# Altium project KA2.PrjPcb (part 1 of 2)
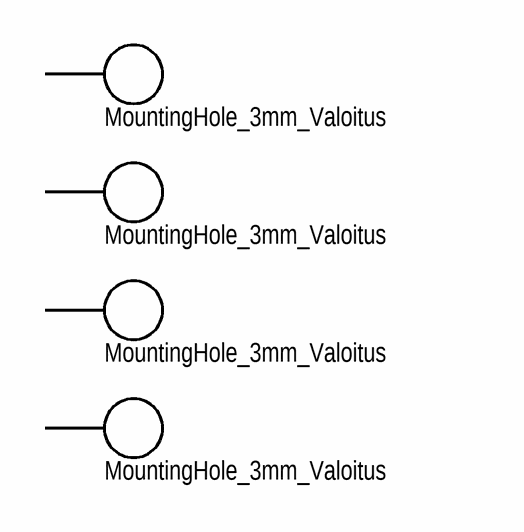
[diagram p0: KA2_1.SchDoc]
6 sheets, 277 parts. Net scope: flat (ports and power ports of the same name join across sheets).
Board file: KA2.PcbDoc
Sheets:
  KA2_1.SchDoc
  KA2_2.SchDoc
  KA2_3.SchDoc
  KA2_4.SchDoc
  KA2_5.SchDoc
  KA2_6.SchDoc

## Sheet KA2_1.SchDoc
size 420 x 297 mm; SheetNumber: 1; SheetTotal: 6

### Parts
H1  MountingHole_3mm_Valoitus  [MountingHole_Valoitus_3.2_5mm]  (no BOM)
H2  MountingHole_3mm_Valoitus  [MountingHole_Valoitus_3.2_5mm]  (no BOM)
H3  MountingHole_3mm_Valoitus  [MountingHole_Valoitus_3.2_5mm]  (no BOM)
H4  MountingHole_3mm_Valoitus  [MountingHole_Valoitus_3.2_5mm]  (no BOM)

### Nets

Not connected (* = marked no-connect by the designer): H1 1; H2 1; H3 1; H4 1

### Notes on the sheet
- Перв. примен.
- Справ. №
- Подп. дата
- Инв. № дубл.
- Взам. инв. №
- Подп. и дата
- Изм.
- Разраб.
- Лист
- № докум.
- Подп.
- Дата
- Лит.
- Масса
- Масштаб
- Пров.
- Т.контр.
- Листов
- Инв. № подл.
- Н.контр.
- Утв.
- ALTIUM GOSTBOM2.0 KEV
- Файл:
- Копировал
- Формат А3

## Sheet KA2_2.SchDoc
size 420 x 297 mm; SheetNumber: 2; SheetTotal: 6
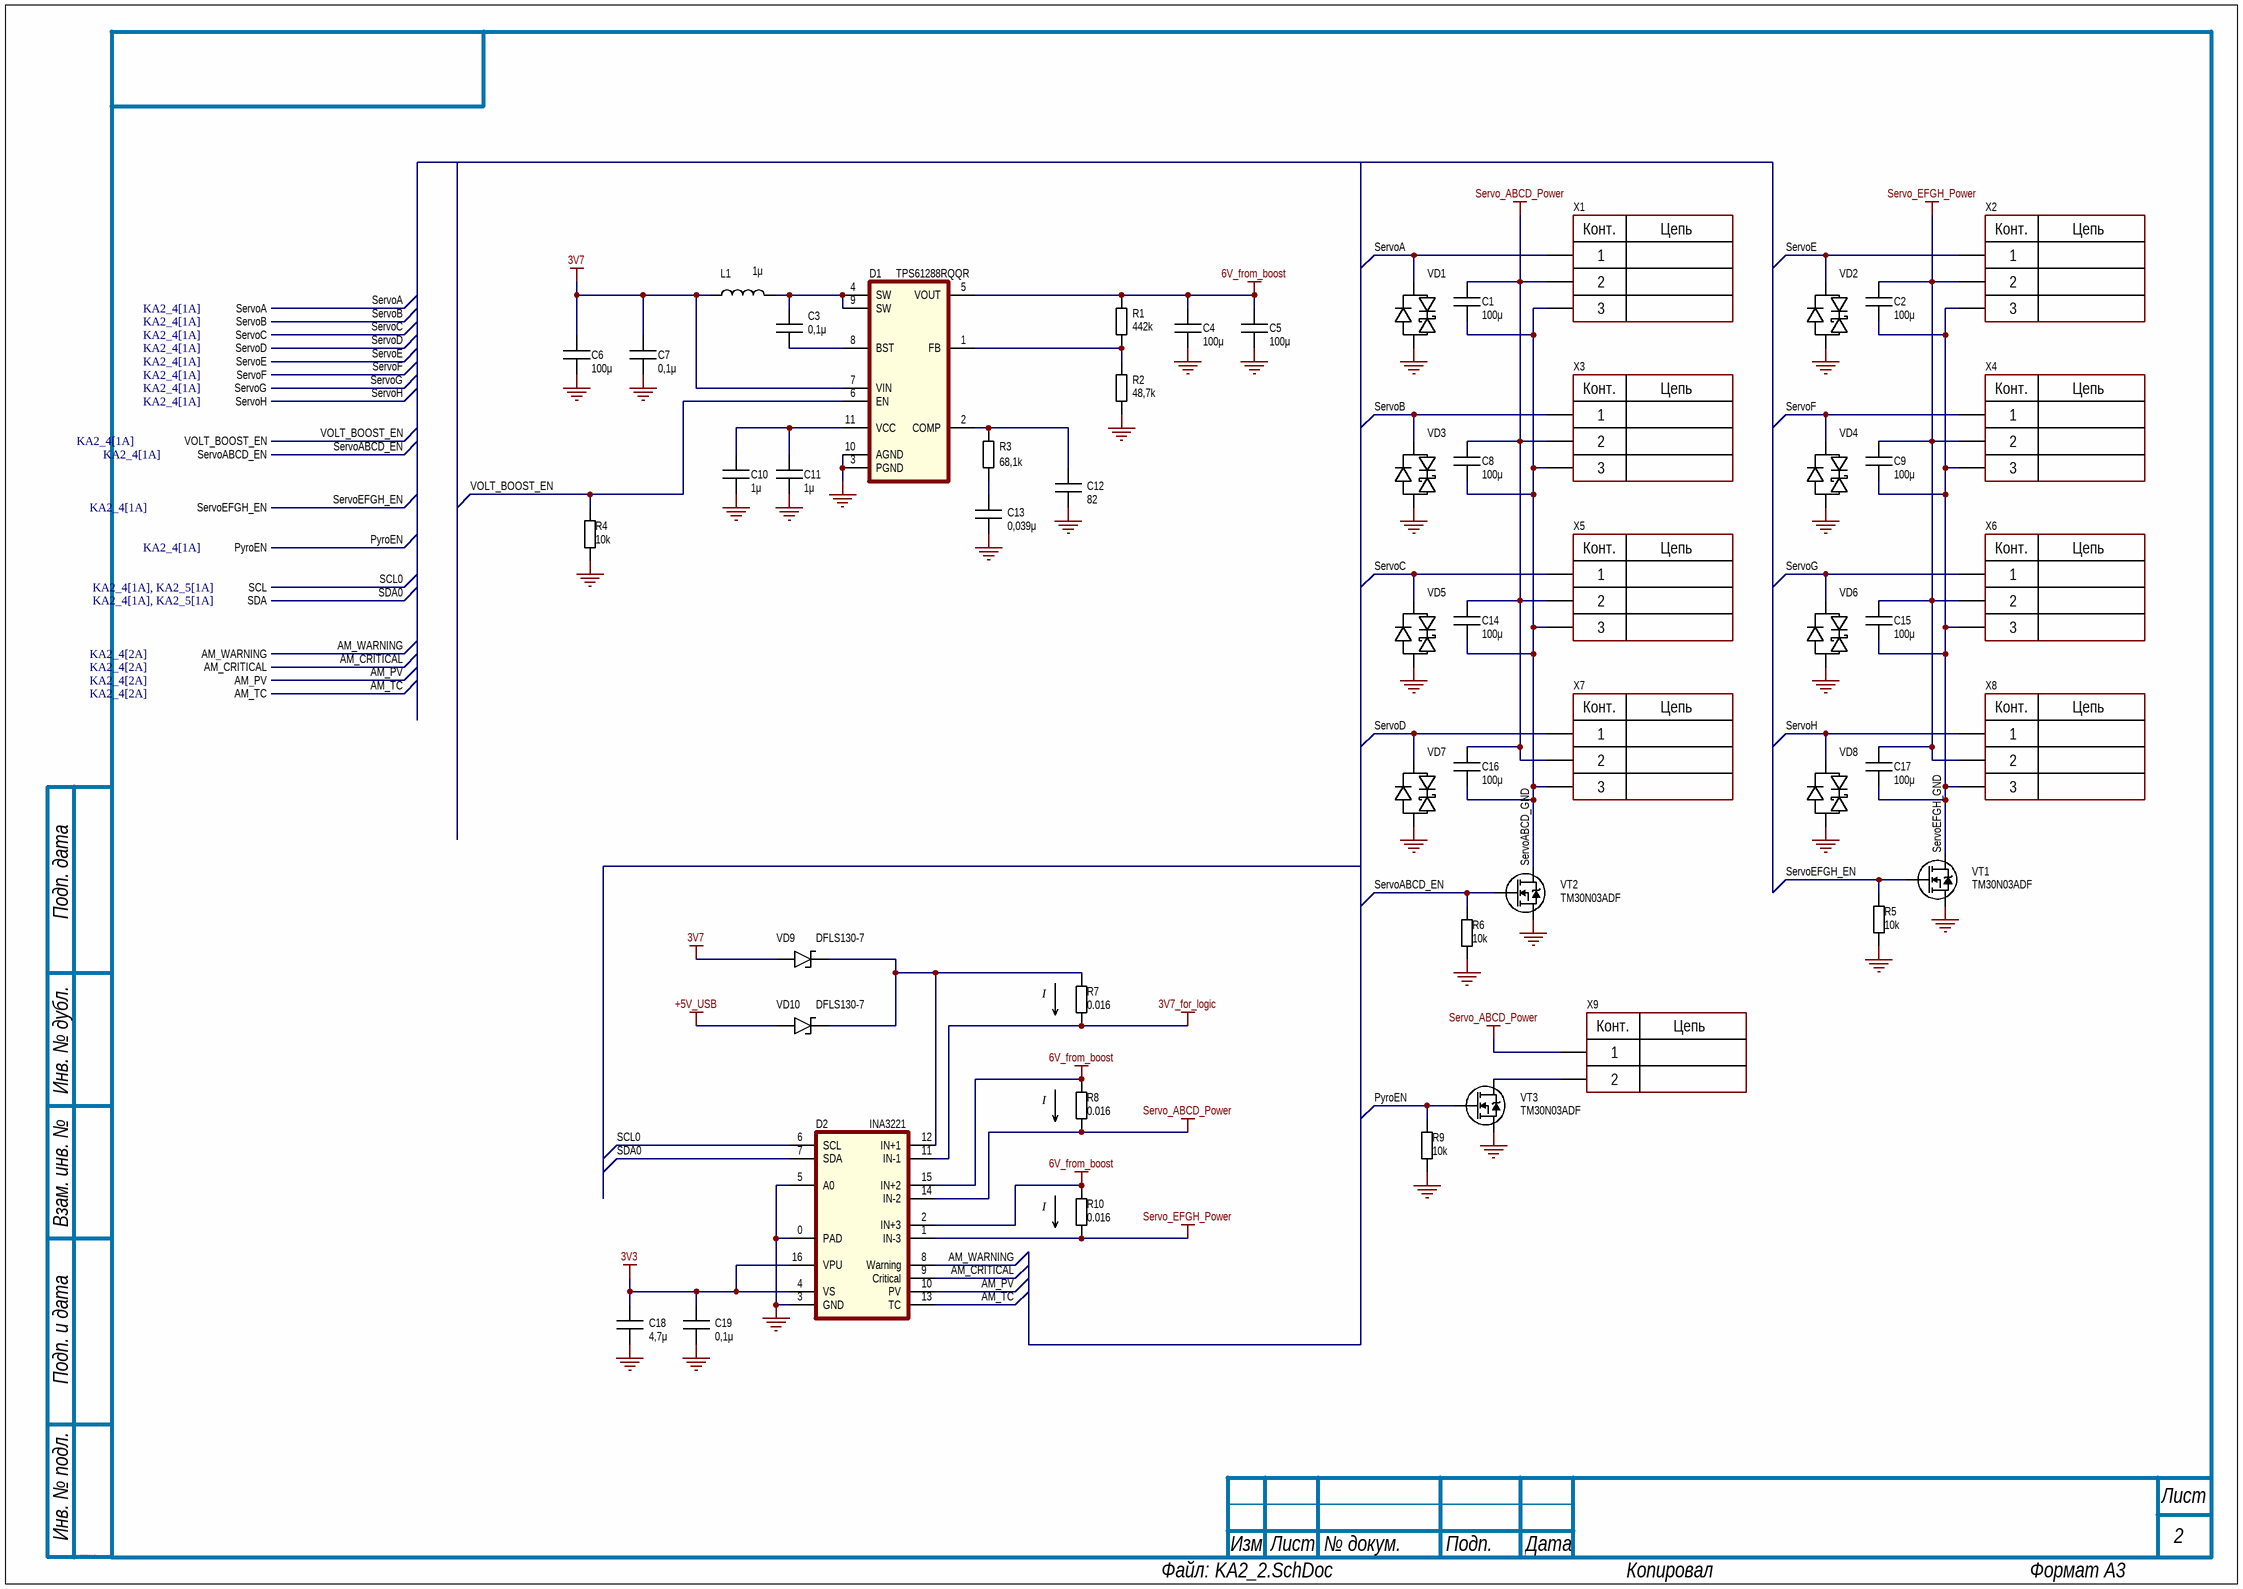
[diagram p1: KA2_2.SchDoc]

### Parts
C1  value 100μ  [Capacitor_1206]
C2  value 100μ  [Capacitor_1206]
C3  value 0,1μ  [Capacitor_0402]
C4  value 100μ  [Capacitor_1206]
C5  value 100μ  [Capacitor_1206]
C6  value 100μ  [Capacitor_1206]
C7  value 0,1μ  [Capacitor_0402]
C8  value 100μ  [Capacitor_1206]
C9  value 100μ  [Capacitor_1206]
C10  value 1μ  [Capacitor_0402]
C11  value 1μ  [Capacitor_0402]
C12  value 82  [Capacitor_0402]
C13  value 0,039μ  [Capacitor_0402]
C14  value 100μ  [Capacitor_1206]
C15  value 100μ  [Capacitor_1206]
C16  value 100μ  [Capacitor_1206]
C17  value 100μ  [Capacitor_1206]
C18  value 4,7μ  [Capacitor_0402]
C19  value 0,1μ  [Capacitor_0402]
D1  value TPS61288RQQR  [TPS61288]  (hidden comment: Boost Switching Regulator IC Adjustable 4.5V~18V 1 Output 15A VQFN-11-HR(2.5x3))
D2  INA3221  [QFN16_4x4mm]
L1  value 1μ  [Inductor_AWLU0730F-1R0MGA]  (hidden comment: 12A 1uH ±20% 7.4mΩ 15A Molded Inductor SMD,7x6.6mm Fixed Inductors RoHS)
R1  value 442k  [RES: 0402]
R2  value 48,7k  [RES: 0402]
R3  value 68,1k  [RES: 0402]
R4  value 10k  [RES: 0402]
R5  value 10k  [RES: 0402]
R6  value 10k  [RES: 0402]
R7  value 0.016  [RES: 1206]
R8  value 0.016  [RES: 1206]
R9  value 10k  [RES: 0402]
R10  value 0.016  [RES: 1206]
VD1  D1213A-01T  [SOD-523]  (value not drawn)
VD2  D1213A-01T  [SOD-523]  (value not drawn)
VD3  D1213A-01T  [SOD-523]  (value not drawn)
VD4  D1213A-01T  [SOD-523]  (value not drawn)
VD5  D1213A-01T  [SOD-523]  (value not drawn)
VD6  D1213A-01T  [SOD-523]  (value not drawn)
VD7  D1213A-01T  [SOD-523]  (value not drawn)
VD8  D1213A-01T  [SOD-523]  (value not drawn)
VD9  value DFLS130-7  [PowerDI-123]  (hidden comment: 1 Independent 30V 420mV@1A 1A PowerDI-123 Single Diodes RoHS)
VD10  value DFLS130-7  [PowerDI-123]  (hidden comment: 1 Independent 30V 420mV@1A 1A PowerDI-123 Single Diodes RoHS)
VT1  TM30N03ADF  [TM30N03ADF]
VT2  TM30N03ADF  [TM30N03ADF]
VT3  TM30N03ADF  [TM30N03ADF]
X1  Connector_JST_XH_B3B-XH-A_1x03_2.50mm  [CONN_JST_XH_B3B-XH-A_1x03_P2.50mm]  (value not drawn)  (no BOM)
X2  Connector_JST_XH_B3B-XH-A_1x03_2.50mm  [CONN_JST_XH_B3B-XH-A_1x03_P2.50mm]  (value not drawn)  (no BOM)
X3  Connector_JST_XH_B3B-XH-A_1x03_2.50mm  [CONN_JST_XH_B3B-XH-A_1x03_P2.50mm]  (value not drawn)  (no BOM)
X4  Connector_JST_XH_B3B-XH-A_1x03_2.50mm  [CONN_JST_XH_B3B-XH-A_1x03_P2.50mm]  (value not drawn)  (no BOM)
X5  Connector_JST_XH_B3B-XH-A_1x03_2.50mm  [CONN_JST_XH_B3B-XH-A_1x03_P2.50mm]  (value not drawn)  (no BOM)
X6  Connector_JST_XH_B3B-XH-A_1x03_2.50mm  [CONN_JST_XH_B3B-XH-A_1x03_P2.50mm]  (value not drawn)  (no BOM)
X7  Connector_JST_XH_B3B-XH-A_1x03_2.50mm  [CONN_JST_XH_B3B-XH-A_1x03_P2.50mm]  (value not drawn)  (no BOM)
X8  Connector_JST_XH_B3B-XH-A_1x03_2.50mm  [CONN_JST_XH_B3B-XH-A_1x03_P2.50mm]  (value not drawn)  (no BOM)
X9  Connector_JST_XH_B2B-XH-A_1x02_2.50mm  [CONN_JST_XH_B2B-XH-A_1x02_P2.50mm]  (value not drawn)  (no BOM)

### Ports
AM_CRITICAL (see KA2_4[2A]), AM_PV (see KA2_4[2A]), AM_TC (see KA2_4[2A]), AM_WARNING (see KA2_4[2A]), PyroEN (see KA2_4[1A]), SCL (see KA2_4[1A], KA2_5[1A]), SDA (see KA2_4[1A], KA2_5[1A]), ServoA (see KA2_4[1A]), ServoABCD_EN (see KA2_4[1A]), ServoB (see KA2_4[1A]), ServoC (see KA2_4[1A]), ServoD (see KA2_4[1A]), ServoE (see KA2_4[1A]), ServoEFGH_EN (see KA2_4[1A]), ServoF (see KA2_4[1A]), ServoG (see KA2_4[1A]), ServoH (see KA2_4[1A]), VOLT_BOOST_EN (see KA2_4[1A])

### Nets
3V3: C18.2 C19.2 D2.4(VS) D2.16(VPU)
3V7: C6.2 C7.2 D1.7(VIN) L1.2 VD9.A(Anode)
3V7_for_logic: D2.11(IN-1) R7.1
6V_from_boost: C4.2 C5.2 D1.5(VOUT) D2.2(IN+3) D2.15(IN+2) R1.2 R8.2 R10.2
+5V_USB: VD10.A(Anode)
GND: C4.1 C5.1 C6.1 C7.1 C10.1 C11.1 C12.1 C13.1 C18.1 C19.1 D1.3(PGND) D1.10(AGND) D2.0(PAD) D2.3(GND) D2.5(A0) R2.1 R4.1 R5.1 R6.1 R9.1 VD1.A VD2.A VD3.A VD4.A VD5.A VD6.A VD7.A VD8.A VT1.S VT2.S VT3.S
Servo_ABCD_Power: C1.2 C8.2 C14.2 C16.2 D2.14(IN-2) R8.1 X1.2 X3.2 X5.2 X7.2 X9.1
Servo_EFGH_Power: C2.2 C9.2 C15.2 C17.2 D2.1(IN-3) R10.1 X2.2 X4.2 X6.2 X8.2
AM_CRITICAL: D2.9(Critical) ; port AM_CRITICAL
AM_PV: D2.10(PV) ; port AM_PV
AM_TC: D2.13(TC) ; port AM_TC
AM_WARNING: D2.8(Warning) ; port AM_WARNING
PyroEN: R9.2 VT3.G ; port PyroEN
SCL0: D2.6(SCL) ; port SCL
SDA0: D2.7(SDA) ; port SDA
ServoA: VD1.K X1.1 ; port ServoA
ServoABCD_EN: R6.2 VT2.G ; port ServoABCD_EN
ServoABCD_GND: C1.1 C8.1 C14.1 C16.1 VT2.D X1.3 X3.3 X5.3 X7.3
ServoB: VD3.K X3.1 ; port ServoB
ServoC: VD5.K X5.1 ; port ServoC
ServoD: VD7.K X7.1 ; port ServoD
ServoE: VD2.K X2.1 ; port ServoE
ServoEFGH_EN: R5.2 VT1.G ; port ServoEFGH_EN
ServoEFGH_GND: C2.1 C9.1 C15.1 C17.1 VT1.D X2.3 X4.3 X6.3 X8.3
ServoF: VD4.K X4.1 ; port ServoF
ServoG: VD6.K X6.1 ; port ServoG
ServoH: VD8.K X8.1 ; port ServoH
VOLT_BOOST_EN: D1.6(EN) R4.2 ; port VOLT_BOOST_EN
NetC3_1: C3.1 D1.8(BST)
NetC3_2: C3.2 D1.4(SW) D1.9(SW) L1.1
NetC10_2: C10.2 C11.2 D1.11(VCC)
NetC12_2: C12.2 D1.2(COMP) R3.2
NetC13_2: C13.2 R3.1
NetD1_1: D1.1(FB) R1.1 R2.2
NetD2_12: D2.12(IN+1) R7.2 VD9.K(Kathode) VD10.K(Kathode)
NetVT3_D: VT3.D X9.2

### Notes on the sheet
- (near R7) I
- (near R8) I
- (near R10) I
- Подп. дата
- Инв. № дубл.
- Взам. инв. №
- Подп. и дата
- Инв. № подл.
- Изм.
- Лист
- № докум.
- Подп.
- Дата
- ALTIUM GOSTBOM2.0 KEV
- Файл:
- Копировал
- Формат А3
- (in symbol Connector_JST_XH_B2B-XH-A_1x02_2.50mm) Конт.; Цепь
- (in symbol Connector_JST_XH_B3B-XH-A_1x03_2.50mm) Конт.; Цепь

### Library data of the parts
C1 C2 C4-C6 C8 C9 C14-C17 = Ceramic_1206: ValueManufacturerPartNumber: Ceramic capacitor, 100μ, X7R, ±10%, 50V, 1206; TypeCapacitor: Ceramic capacitor; Tolerance: ±10%; TypeDielectric: X7R; Voltage: 50V; Manufacturer: *; HelpURL: *; Package: 1206; Mfr.Part: *
C3 C7 C19 = Ceramic_0402: ValueManufacturerPartNumber: Ceramic capacitor, 0,1μ, X7R, ±10%, 16V, 0402; TypeCapacitor: Ceramic capacitor; Tolerance: ±10%; TypeDielectric: X7R; Voltage: 16V; Manufacturer: *; HelpURL: *; Package: 0402; Mfr.Part: *
C10 C11 = Ceramic_0402: ValueManufacturerPartNumber: Ceramic capacitor, 1μ, X7R, ±10%, 16V, 0402; TypeCapacitor: Ceramic capacitor; Tolerance: ±10%; TypeDielectric: X7R; Voltage: 16V; Manufacturer: *; HelpURL: *; Package: 0402; Mfr.Part: *
C12 = Ceramic_0402: ValueManufacturerPartNumber: Ceramic capacitor, 82, X7R, ±10%, 16V, 0402; TypeCapacitor: Ceramic capacitor; Tolerance: ±10%; TypeDielectric: X7R; Voltage: 16V; Manufacturer: *; HelpURL: *; Package: 0402; Mfr.Part: *
C13 = Ceramic_0402: ValueManufacturerPartNumber: Ceramic capacitor, 0,039μ, X7R, ±10%, 16V, 0402; TypeCapacitor: Ceramic capacitor; Tolerance: ±10%; TypeDielectric: X7R; Voltage: 16V; Manufacturer: *; HelpURL: *; Package: 0402; Mfr.Part: *
C18 = Ceramic_0402: ValueManufacturerPartNumber: Ceramic capacitor, 4,7μ, X7R, ±10%, 16V, 0402; TypeCapacitor: Ceramic capacitor; Tolerance: ±10%; TypeDielectric: X7R; Voltage: 16V; Manufacturer: *; HelpURL: *; Package: 0402; Mfr.Part: *
D1 = TPS61288RQQR: Manufacturer: Texas Instruments; Mfr.Part: TPS61288RQQR; HelpURL: https://www.lcsc.com/product-image/C5219223.html
D2 = INA3221: Микросхема трехканального амперметра-вольтметра; Manufacturer: Texas Instruments; Mfr.Part: INA3221AIRGVR; Value: INA3221; HelpURL: https://www.lcsc.com/product-detail/C181255.html
L1 = Inductor_AWLU0730F-1R0MGA: 17A 1uH ±20% 3.8mΩ 21A Molded Inductor SMD,7.2x7mm Fixed Inductors RoHS; Manufacturer: APV; Mfr.Part: AWLU0730F-1R0MGA; HelpURL: https://www.lcsc.com/product-detail/C54123597.html
R1 = Resistor_0402: ValueManufacturerPartNumber: Resistor, 442k, ±1%, 0402; Tolerance: ±1%; Manufacturer: *; Package: 0402; Mfr.Part: *; TypeResistor: Resistor; HelpURL: *
R2 = Resistor_0402: ValueManufacturerPartNumber: Resistor, 48,7k, ±1%, 0402; Tolerance: ±1%; Manufacturer: *; Package: 0402; Mfr.Part: *; TypeResistor: Resistor; HelpURL: *
R3 = Resistor_0402: ValueManufacturerPartNumber: Resistor, 68,1k, ±1%, 0402; Tolerance: ±1%; Manufacturer: *; Package: 0402; Mfr.Part: *; TypeResistor: Resistor; HelpURL: *
R4-R6 R9 = Resistor_0402: ValueManufacturerPartNumber: Resistor, 10k, ±1%, 0402; Tolerance: ±1%; Manufacturer: *; Package: 0402; Mfr.Part: *; TypeResistor: Resistor; HelpURL: *
R7 R8 R10 = Resistor_1206: ValueManufacturerPartNumber: Resistor, 0.016, ±1%, 1206; Tolerance: ±1%; Manufacturer: *; Package: 1206; HelpURL: *; TypeResistor: Resistor; Mfr.Part: *
VD1-VD8 = D1213A-01T: Manufacturer: Diodes; Mfr.Part: D1213A-01T-7; Value: D1213A-01T-7; HelpURL: https://www.lcsc.com/product-detail/C460584.html
VD9 VD10 = Diode_DFLS130-7: Диод Шоттки 30V 420mV@1A 1A PowerDI-123; Mfr.Part: DFLS130-7; Manufacturer: DIODES; HelpURL: https://www.lcsc.com/product-detail/C150474.html
VT1-VT3 = TM30N03ADF: Транзистор N-канальный, 30В 30А 15Вт, DFN3x3-8; Manufacturer: Tritech-MOS; Mfr.Part: TM30N03ADF; Value: TM30N03ADF; HelpURL: https://www.lcsc.com/product-detail/C7422839.html
X1-X8 = Connector_JST_XH_B3B-XH-A_1x03_2.50mm: 3-pin through-hole connector
X9 = Connector_JST_XH_B2B-XH-A_1x02_2.50mm: 2-pin through-hole connector

## Sheet KA2_3.SchDoc
size 420 x 297 mm; SheetNumber: 3; SheetTotal: 6
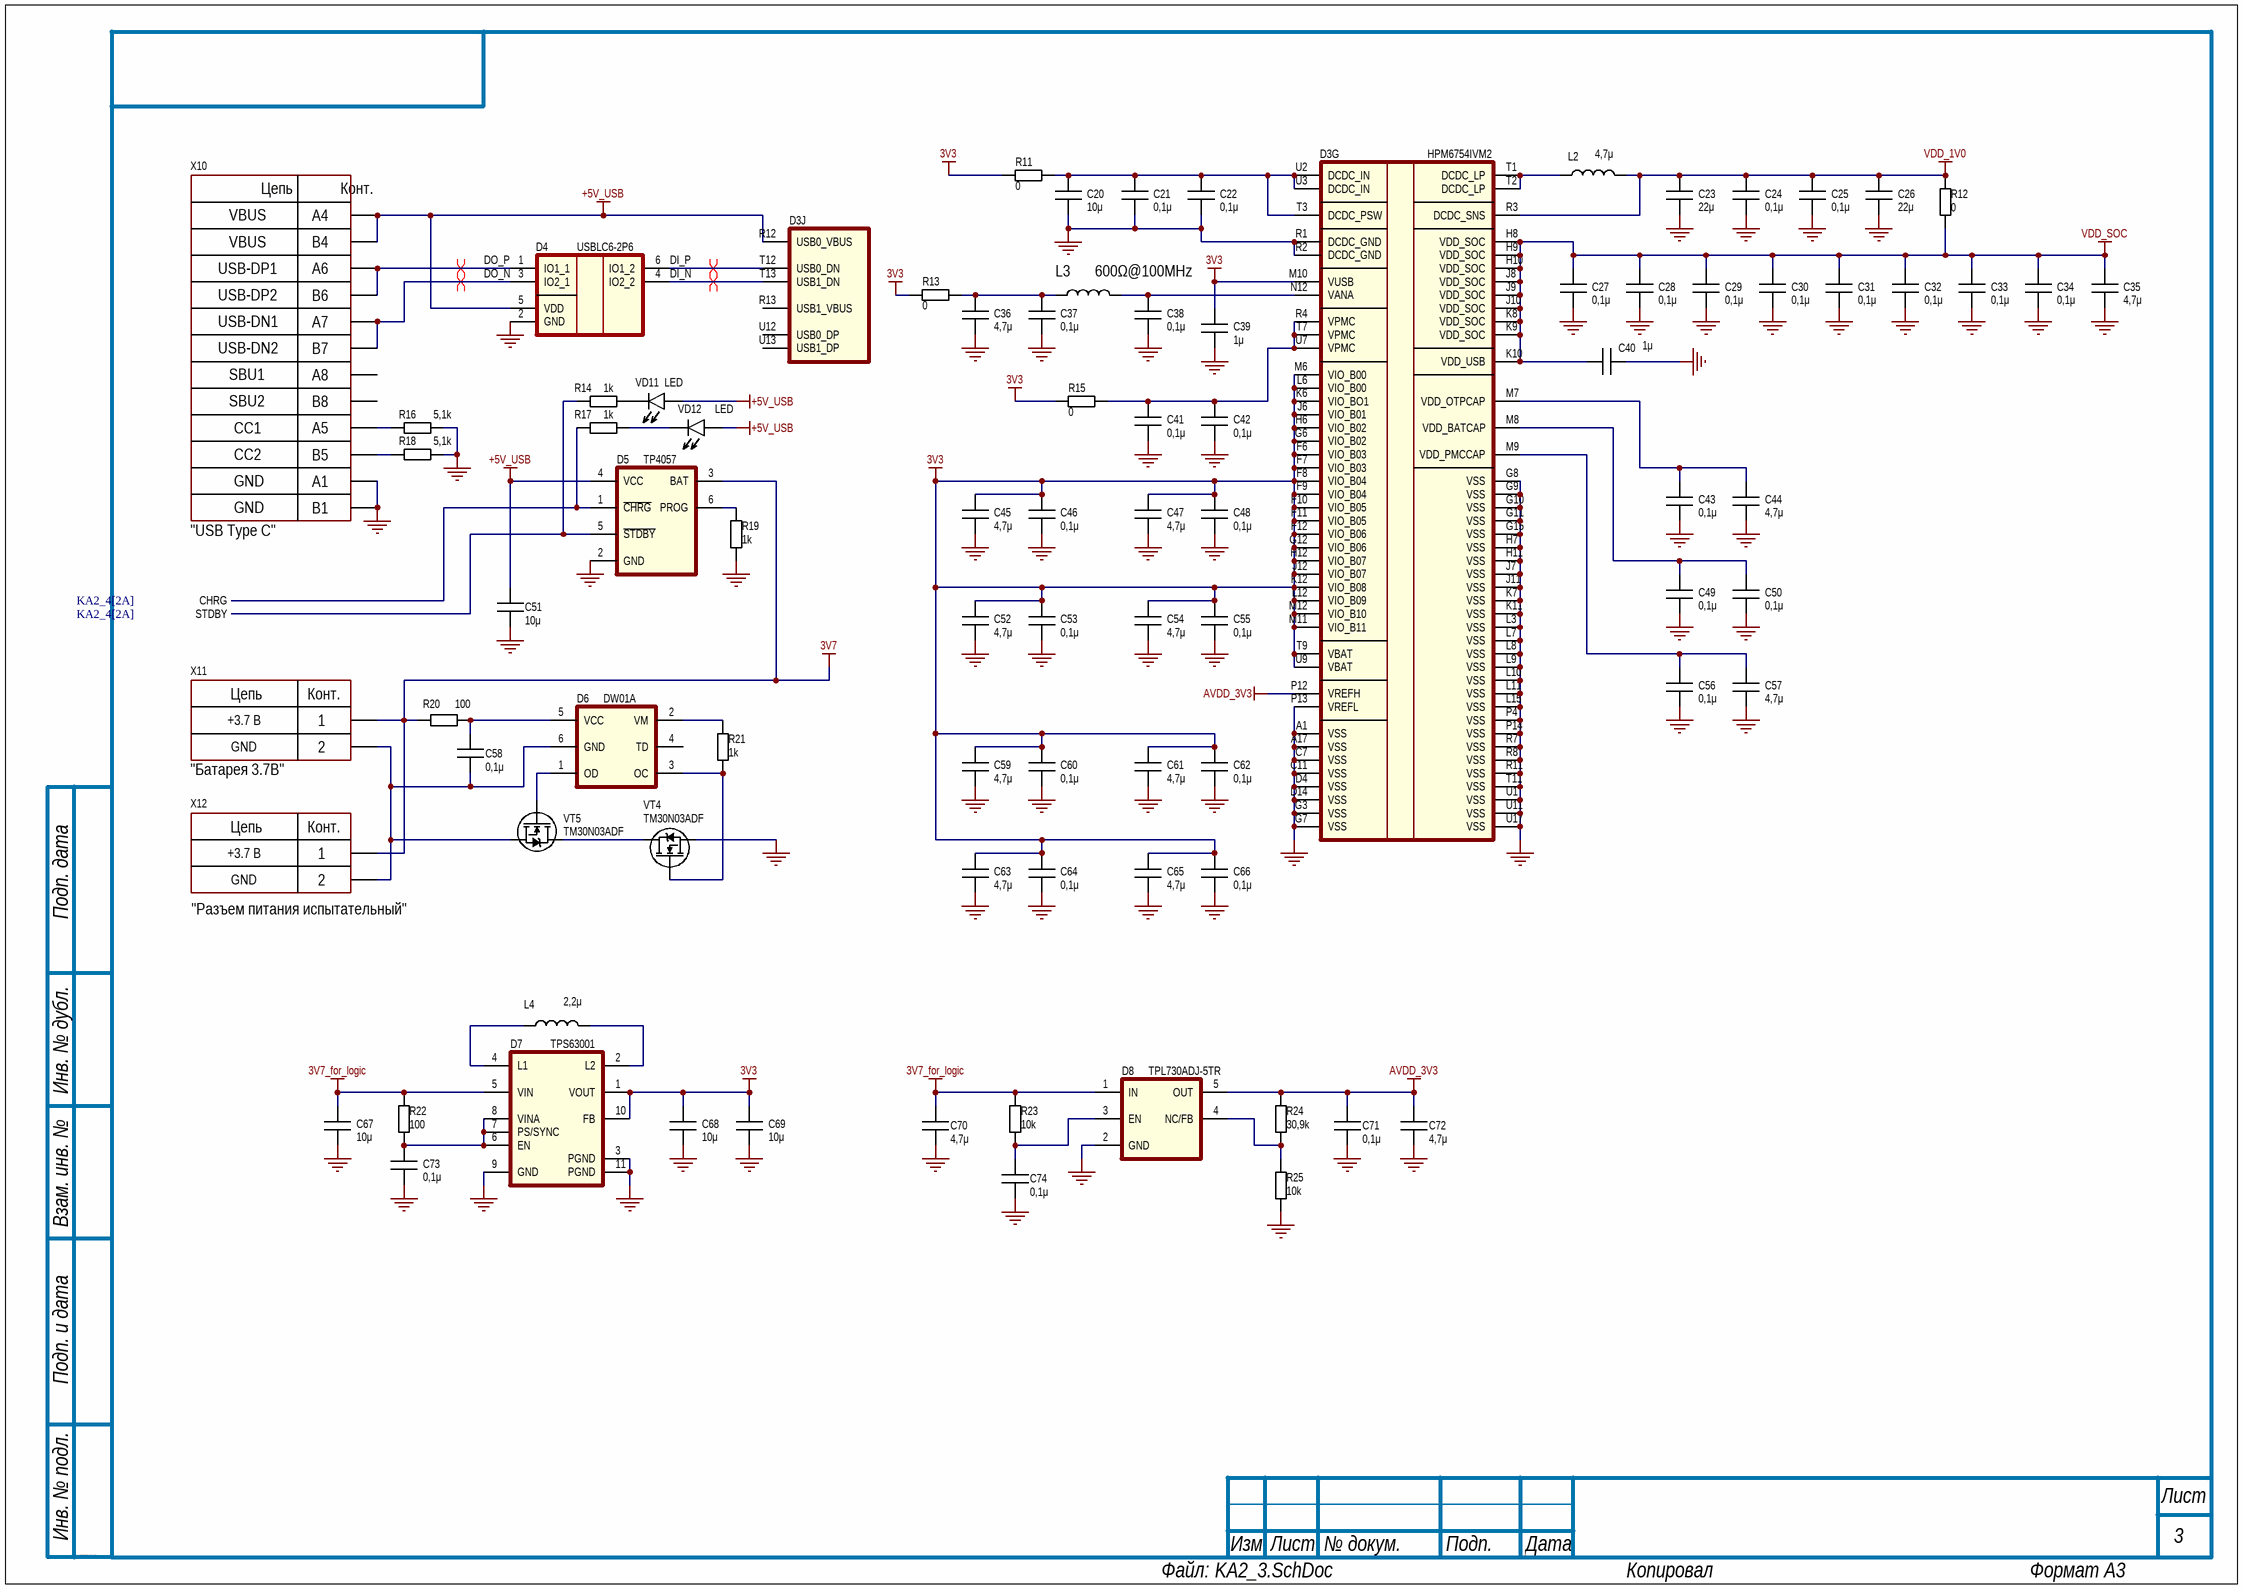
[diagram p2: KA2_3.SchDoc]

### Parts
C20  value 10μ  [Capacitor_0402]
C21  value 0,1μ  [Capacitor_0402]
C22  value 0,1μ  [Capacitor_0402]
C23  value 22μ  [Capacitor_0402]
C24  value 0,1μ  [Capacitor_0402]
C25  value 0,1μ  [Capacitor_0402]
C26  value 22μ  [Capacitor_0402]
C27  value 0,1μ  [Capacitor_0402]
C28  value 0,1μ  [Capacitor_0402]
C29  value 0,1μ  [Capacitor_0402]
C30  value 0,1μ  [Capacitor_0402]
C31  value 0,1μ  [Capacitor_0402]
C32  value 0,1μ  [Capacitor_0402]
C33  value 0,1μ  [Capacitor_0402]
C34  value 0,1μ  [Capacitor_0402]
C35  value 4,7μ  [Capacitor_0402]
C36  value 4,7μ  [Capacitor_0402]
C37  value 0,1μ  [Capacitor_0402]
C38  value 0,1μ  [Capacitor_0402]
C39  value 1μ  [Capacitor_0402]
C40  value 1μ  [Capacitor_0402]
C41  value 0,1μ  [Capacitor_0402]
C42  value 0,1μ  [Capacitor_0402]
C43  value 0,1μ  [Capacitor_0402]
C44  value 4,7μ  [Capacitor_0402]
C45  value 4,7μ  [Capacitor_0402]
C46  value 0,1μ  [Capacitor_0402]
C47  value 4,7μ  [Capacitor_0402]
C48  value 0,1μ  [Capacitor_0402]
C49  value 0,1μ  [Capacitor_0402]
C50  value 0,1μ  [Capacitor_0402]
C51  value 10μ  [Capacitor_0402]
C52  value 4,7μ  [Capacitor_0402]
C53  value 0,1μ  [Capacitor_0402]
C54  value 4,7μ  [Capacitor_0402]
C55  value 0,1μ  [Capacitor_0402]
C56  value 0,1μ  [Capacitor_0402]
C57  value 4,7μ  [Capacitor_0402]
C58  value 0,1μ  [Capacitor_0402]
C59  value 4,7μ  [Capacitor_0402]
C60  value 0,1μ  [Capacitor_0402]
C61  value 4,7μ  [Capacitor_0402]
C62  value 0,1μ  [Capacitor_0402]
C63  value 4,7μ  [Capacitor_0402]
C64  value 0,1μ  [Capacitor_0402]
C65  value 4,7μ  [Capacitor_0402]
C66  value 0,1μ  [Capacitor_0402]
C67  value 10μ  [Capacitor_0402]
C68  value 10μ  [Capacitor_0402]
C69  value 10μ  [Capacitor_0402]
C70  value 4,7μ  [Capacitor_0402]
C71  value 0,1μ  [Capacitor_0402]
C72  value 4,7μ  [Capacitor_0402]
C73  value 0,1μ  [Capacitor_0402]
C74  value 0,1μ  [Capacitor_0402]
D3  HPM6754IVM2  [HPM6754IVM2_BGA-289_14x14mm]  (parts G,J of 11)
D4  USBLC6-2P6  [SOT-666]
D5  TP4057  [SOT23-6]
D6  DW01A  [SOT23-6]
D7  TPS63001  [TPS6300x]
D8  value TPL730ADJ-5TR  [SOT-23-5]  (hidden comment: TPL730ADJ-5TL)
L2  value 4,7μ  [Inductor_1008]  (hidden comment: 1.55A 4.7uH ±20% 1.9A 196mΩ Magnetic Shielded Inductor 1008 Fixed Inductors RoHS)
L3  value 600Ω@100MHz  [IND: 0603]
L4  value 2,2μ  [Inductor_1008]  (hidden comment: 3A 2.2uH ±20% 55mΩ 3.8A 1008 Fixed Inductors RoHS)
R11  value 0  [RES: 0805]
R12  value 0  [RES: 0805]
R13  value 0  [RES: 0805]
R14  value 1k  [RES: 0402]
R15  value 0  [RES: 0805]
R16  value 5,1k  [RES: 0402]
R17  value 1k  [RES: 0402]
R18  value 5,1k  [RES: 0402]
R19  value 1k  [RES: 0402]
R20  value 100  [RES: 0402]
R21  value 1k  [RES: 0402]
R22  value 100  [RES: 0805]
R23  value 10k  [RES: 0402]
R24  value 30,9k  [RES: 0402]
R25  value 10k  [RES: 0402]
VD11  value LED  [LED: 0603Y]  (hidden comment: LED_0603_Y)
VD12  value LED  [LED: 0603Y]  (hidden comment: Red 625nm LED Indication - Discrete 2.3V 0603)
VT4  TM30N03ADF  [TM30N03ADF]
VT5  TM30N03ADF  [TM30N03ADF]
X10  CommentText: "USB Type C"  [CON: TYPE-C-31-M-12]  (hidden comment: USB-C (USB TYPE-C) Receptacle Connector 16 Position Surface Mount)
X11  "Батарея 3.7В"  [CONN_BATTERY_3V7_V2]  (no BOM)
X12  "Разъем питания испытательный"  [CONN_JST_XH_B2B-XH-A_1x02_P2.50mm]  (no BOM)

### Ports
CHRG (see KA2_4[2A]), STDBY (see KA2_4[2A])

### Nets
3V3: C39.2 C45.2 C46.2 C47.2 C48.2 C52.2 C53.2 C54.2 C55.2 C59.2 C60.2 C61.2 C62.2 C63.2 C64.2 C65.2 C66.2 C68.2 C69.2 D3.F6(VIO_B03) D3.F7(VIO_B03) D3.F8(VIO_B04) D3.F9(VIO_B04) D3.F10(VIO_B05) D3.F11(VIO_B05) D3.F12(VIO_B06) D3.G6(VIO_B02) D3.G12(VIO_B06) D3.H6(VIO_B02) D3.H12(VIO_B07) D3.J6(VIO_B01) D3.J12(VIO_B07) D3.K6(VIO_BO1) D3.K12(VIO_B08) D3.L6(VIO_B00) D3.L12(VIO_B09) D3.M6(VIO_B00) D3.M10(VUSB) D3.M11(VIO_B11) D3.M12(VIO_B10) D3.T9(VBAT) D3.U9(VBAT) D7.1(VOUT) D7.10(FB) R11.2 R13.2 R15.2
3V7: D5.3(BAT) R20.1 X11.1 X12.1
3V7_for_logic: C67.2 C70.2 D7.5(VIN) D8.1(IN) R22.1 R23.2
+5V_USB: C51.2 D3.R12(USB0_VBUS) D4.5(VDD) D5.4(VCC) VD11.A(Anode) VD12.A(Anode) X10.A4 X10.B4
AVDD_3V3: C71.2 C72.2 D3.P12(VREFH) D8.5(OUT) R24.2
GND: C20.1 C21.1 C22.1 C23.1 C24.1 C25.1 C26.1 C27.1 C28.1 C29.1 C30.1 C31.1 C32.1 C33.1 C34.1 C35.1 C36.1 C37.1 C38.1 C39.1 C40.1 C41.1 C42.1 C43.1 C44.1 C45.1 C46.1 C47.1 C48.1 C49.1 C50.1 C51.1 C52.1 C53.1 C54.1 C55.1 C56.1 C57.1 C59.1 C60.1 C61.1 C62.1 C63.1 C64.1 C65.1 C66.1 C67.1 C68.1 C69.1 C70.1 C71.1 C72.1 C73.1 C74.1 D3.A1(VSS) D3.A17(VSS) D3.C7(VSS) D3.C11(VSS) D3.D4(VSS) D3.D14(VSS) D3.G3(VSS) D3.G7(VSS) D3.G8(VSS) D3.G9(VSS) D3.G10(VSS) D3.G11(VSS) D3.G15(VSS) D3.H7(VSS) D3.H11(VSS) D3.J7(VSS) D3.J11(VSS) D3.K7(VSS) D3.K11(VSS) D3.L3(VSS) D3.L7(VSS) D3.L8(VSS) D3.L9(VSS) D3.L10(VSS) D3.L11(VSS) D3.L15(VSS) D3.P4(VSS) D3.P13(VREFL) D3.P14(VSS) D3.R1(DCDC_GND) D3.R2(DCDC_GND) D3.R7(VSS) D3.R8(VSS) D3.R11(VSS) D3.T11(VSS) D3.U1(VSS) D3.U11(VSS) D3.U17(VSS) D4.2(GND) D5.2(GND) D7.3(PGND) D7.9(GND) D7.11(PGND) D8.2(GND) R16.2 R18.2 R19.1 R25.1 VT4.S X10.A1 X10.B1
VDD_1V0: C23.2 C24.2 C25.2 C26.2 D3.R3(DCDC_SNS) L2.1 R12.2
VDD_SOC: C27.2 C28.2 C29.2 C30.2 C31.2 C32.2 C33.2 C34.2 C35.2 C40.2 D3.H8(VDD_SOC) D3.H9(VDD_SOC) D3.H10(VDD_SOC) D3.J8(VDD_SOC) D3.J9(VDD_SOC) D3.J10(VDD_SOC) D3.K8(VDD_SOC) D3.K9(VDD_SOC) D3.K10(VDD_USB) R12.1
CHRG: D5.1(~{CHRG}) R17.1 ; port CHRG
DI_N: D3.T13(USB1_DN) D4.4(IO2_2)
DI_P: D3.T12(USB0_DN) D4.6(IO1_2)
DO_N: D4.3(IO2_1) X10.A7 X10.B7
DO_P: D4.1(IO1_1) X10.A6 X10.B6
STDBY: D5.5(~{STDBY}) R14.1 ; port STDBY
NetC20_2: C20.2 C21.2 C22.2 D3.T3(DCDC_PSW) D3.U2(DCDC_IN) D3.U3(DCDC_IN) R11.1
NetC36_2: C36.2 C37.2 L3.2 R13.1
NetC38_2: C38.2 D3.N12(VANA) L3.1
NetC41_2: C41.2 C42.2 D3.R4(VPMC) D3.T7(VPMC) D3.U7(VPMC) R15.1
NetC43_2: C43.2 C44.2 D3.M7(VDD_OTPCAP)
NetC49_2: C49.2 C50.2 D3.M8(VDD_BATCAP)
NetC56_2: C56.2 C57.2 D3.M9(VDD_PMCCAP)
NetC58_1: C58.1 D6.6(GND) VT5.S X11.2 X12.2
NetC58_2: C58.2 D6.5(VCC) R20.2
NetC73_2: C73.2 D7.6(EN) D7.7(PS/SYNC) D7.8(VINA) R22.2
NetC74_2: C74.2 D8.3(EN) R23.1
NetD3_T1: D3.T1(DCDC_LP) D3.T2(DCDC_LP) L2.2
NetD5_6: D5.6(PROG) R19.2
NetD6_1: D6.1(OD) VT5.G
NetD6_2: D6.2(VM) R21.2
NetD6_3: D6.3(OC) R21.1 VT4.G
NetD7_2: D7.2(L2) L4.1
NetD7_4: D7.4(L1) L4.2
NetD8_4: D8.4(NC/FB) R24.1 R25.2
NetR14_2: R14.2 VD11.K(Kathode)
NetR16_1: R16.1 X10.A5
NetR17_2: R17.2 VD12.K(Kathode)
NetR18_1: R18.1 X10.B5
NetVT4_D: VT4.D VT5.D

Not connected (* = marked no-connect by the designer): D3 R13(USB1_VBUS) U12(USB0_DP) U13(USB1_DP); D6 4(TD); X10 A8 B8

### Layout directives
differential pair: DI_N, DI_P, DO_N, DO_P

### Notes on the sheet
- +3.7 В
- GND
- Подп. дата
- Инв. № дубл.
- Взам. инв. №
- Подп. и дата
- Инв. № подл.
- Изм.
- Лист
- № докум.
- Подп.
- Дата
- ALTIUM GOSTBOM2.0 KEV
- Файл:
- Копировал
- Формат А3
- (in symbol Connector_Battery) Цепь; Конт.; +3.7 В; GND
- (in symbol Connector_JST_XH_B2B-XH-A_1x02_2.50mm) Цепь; Конт.
- (in symbol Connector_USB_Type_C) Цепь; Конт.; VBUS; USB-DP1; USB-DP2; USB-DN1; USB-DN2; SBU1; SBU2; CC1; CC2; GND

### Library data of the parts
C20 C51 C67-C69 = Ceramic_0402: ValueManufacturerPartNumber: Ceramic capacitor, 10μ, X7R, ±10%, 16V, 0402; TypeCapacitor: Ceramic capacitor; Tolerance: ±10%; TypeDielectric: X7R; Voltage: 16V; Manufacturer: *; HelpURL: *; Package: 0402; Mfr.Part: *
C21 C22 C24 C25 C27-C34 C37 C38 C41-C43 C46 C48-C50 C53 C55 C56 C58 C60 C62 C64 C66 C71 C73 C74 = Ceramic_0402: as C3 on sheet KA2_2; Manufacturer: *; HelpURL: *; Package: 0402; Mfr.Part: *
C23 C26 = Ceramic_0402: ValueManufacturerPartNumber: Ceramic capacitor, 22μ, X7R, ±10%, 16V, 0402; TypeCapacitor: Ceramic capacitor; Tolerance: ±10%; TypeDielectric: X7R; Voltage: 16V; Manufacturer: *; HelpURL: *; Package: 0402; Mfr.Part: *
C35 C36 C44 C45 C47 C52 C54 C57 C59 C61 C63 C65 C70 C72 = Ceramic_0402: as C18 on sheet KA2_2; Manufacturer: *; HelpURL: *; Package: 0402; Mfr.Part: *
C39 C40 = Ceramic_0402: as C10 on sheet KA2_2; Manufacturer: *; HelpURL: *; Package: 0402; Mfr.Part: *
D3 = HPM6754IVM2: Микроконтроллер RISC-V, 2xRV32GCBP@816МГц, 2МБ ОЗУ, BGA-289 14x14mm; Manufacturer: HPMICRO; Mfr.Part: HPM6754IVM2; Value: HPM6754IVM2; HelpURL: https://www.lcsc.com/product-detail/C49451874.html
D4 = USBLC6-2P6: Микросхема защиты USB от статики, SOT-666; Manufacturer: STMicroelectronics; Mfr.Part: USBLC6-2P6; Value: USBLC6-2P6; HelpURL: https://www.lcsc.com/product-detail/C15999.html
D5 = TP4057: Микросхема зарядки li-ion барареи, SOT-23-6; Manufacturer: JSMSEMI; Mfr.Part: TP4057; Value: TP4057; HelpURL: https://www.lcsc.com/product-detail/C20606861.html
D6 = DW01A: Микросхема защиты li-ion-батареи; Mfr.Part: DW01A-JSM; Manufacturer: JSMSEMI; Value: DW01A; HelpURL: https://www.lcsc.com/product-detail/C39846919.html
D7 = TPS63001: Микросхема драйвера повышающе-понижающего преобразователя, вход 1,8...5,5В, выход 3,3В, 800-1200мА; Mfr.Part: TPS63001DRCR; Manufacturer: Texas Instruments; Value: TPS63001; HelpURL: https://www.lcsc.com/product-detail/C28060.html
D8 = TPL730ADJ-5TL: Микросхема драйвера импульсного понижающего преобразователя; Manufacturer: 3PEAK; Mfr.Part: TPL730ADJ-5TR; HelpURL: https://www.lcsc.com/product-detail/C2690181.html
L2 = Inductor_FWP252012P-4R7ML: Manufacturer: cjiang; Mfr.Part: FWP252012P-4R7ML; HelpURL: https://www.lcsc.com/product-detail/C5179447.html
L3 = Inductor_0603: ValueManufacturerPartNumber: Inductor, 600Ω@100MHz, ±10%, 0603; Tolerance: ±10%; Manufacturer: *; Mfr.Part: *; Package: 0603; HelpURL: *; TypeInductor: Inductor
L4 = Inductor_FTC252012S2R2MBCA: Manufacturer: cjiang; Mfr.Part: FTC252012S2R2MBCA; HelpURL: https://www.lcsc.com/product-detail/C5832372.html
R11-R13 R15 = Resistor_0805: ValueManufacturerPartNumber: Resistor, 0, ±1%, 0805; Tolerance: ±1%; Manufacturer: *; Package: 0805; HelpURL: *; TypeResistor: Resistor; Mfr.Part: *
R14 R17 R21 = Resistor_0402: ValueManufacturerPartNumber: Resistor, 1k, ±1%, 0402; Tolerance: ±1%; Manufacturer: *; Package: 0402; Mfr.Part: *; TypeResistor: Resistor; HelpURL: *
R16 R18 = Resistor_0402: ValueManufacturerPartNumber: Resistor, 5,1k, ±1%, 0402; Tolerance: ±1%; Manufacturer: *; Package: 0402; Mfr.Part: *; TypeResistor: Resistor; HelpURL: *
R19 = Resistor_0402: Manufacturer: Yageo; ValueManufacturerPartNumber: Resistor, 1k, ±1%, 0402; Tolerance: ±1%; Package: 0402; TypeResistor: Resistor
R20 = Resistor_0402: ValueManufacturerPartNumber: Resistor, 100, ±1%, 0402; Tolerance: ±1%; Manufacturer: *; Package: 0402; Mfr.Part: *; TypeResistor: Resistor; HelpURL: *
R22 = Resistor_0805: ValueManufacturerPartNumber: Resistor, 100, ±1%, 0805; Tolerance: ±1%; Manufacturer: *; Package: 0805; HelpURL: *; TypeResistor: Resistor; Mfr.Part: *
R23 R25 = Resistor_0402: as R4 on sheet KA2_2; Manufacturer: *; Package: 0402; Mfr.Part: *; TypeResistor: Resistor; HelpURL: *
R24 = Resistor_0402: ValueManufacturerPartNumber: Resistor, 30,9k, ±1%, 0402; Tolerance: ±1%; Manufacturer: *; Package: 0402; Mfr.Part: *; TypeResistor: Resistor; HelpURL: *
VD11 = LED_0603_Y: Светодиод желтый, 0603; Mfr.Part: TJ-S1608CY6T5ALC9Y-A5; Manufacturer: TOGIALED; HelpURL: https://www.lcsc.com/product-detail/C2837010.html
VD12 = LED_0603_R: Светодиод красный, 0603; Mfr.Part: XL-1608SURC-06; Manufacturer: XINGLIGHT; HelpURL: https://www.lcsc.com/product-detail/C965799.html
VT4 VT5 = TM30N03ADF: as VT1 on sheet KA2_2; Mfr.Part: TM30N03ADF; Value: TM30N03ADF; HelpURL: https://www.lcsc.com/product-detail/C7422839.html
X10 = Connector_USB_Type_C: 16-pin USB-C connector, surface mount; Manufacturer: HDGC; Mfr.Part: TYPE C-DB-116PWB; HelpURL: https://www.lcsc.com/product-detail/C7395062.html
X11 = Connector_Battery
X12 = Connector_JST_XH_B2B-XH-A_1x02_2.50mm

## Sheet KA2_4.SchDoc
size 420 x 297 mm; SheetNumber: 4; SheetTotal: 6
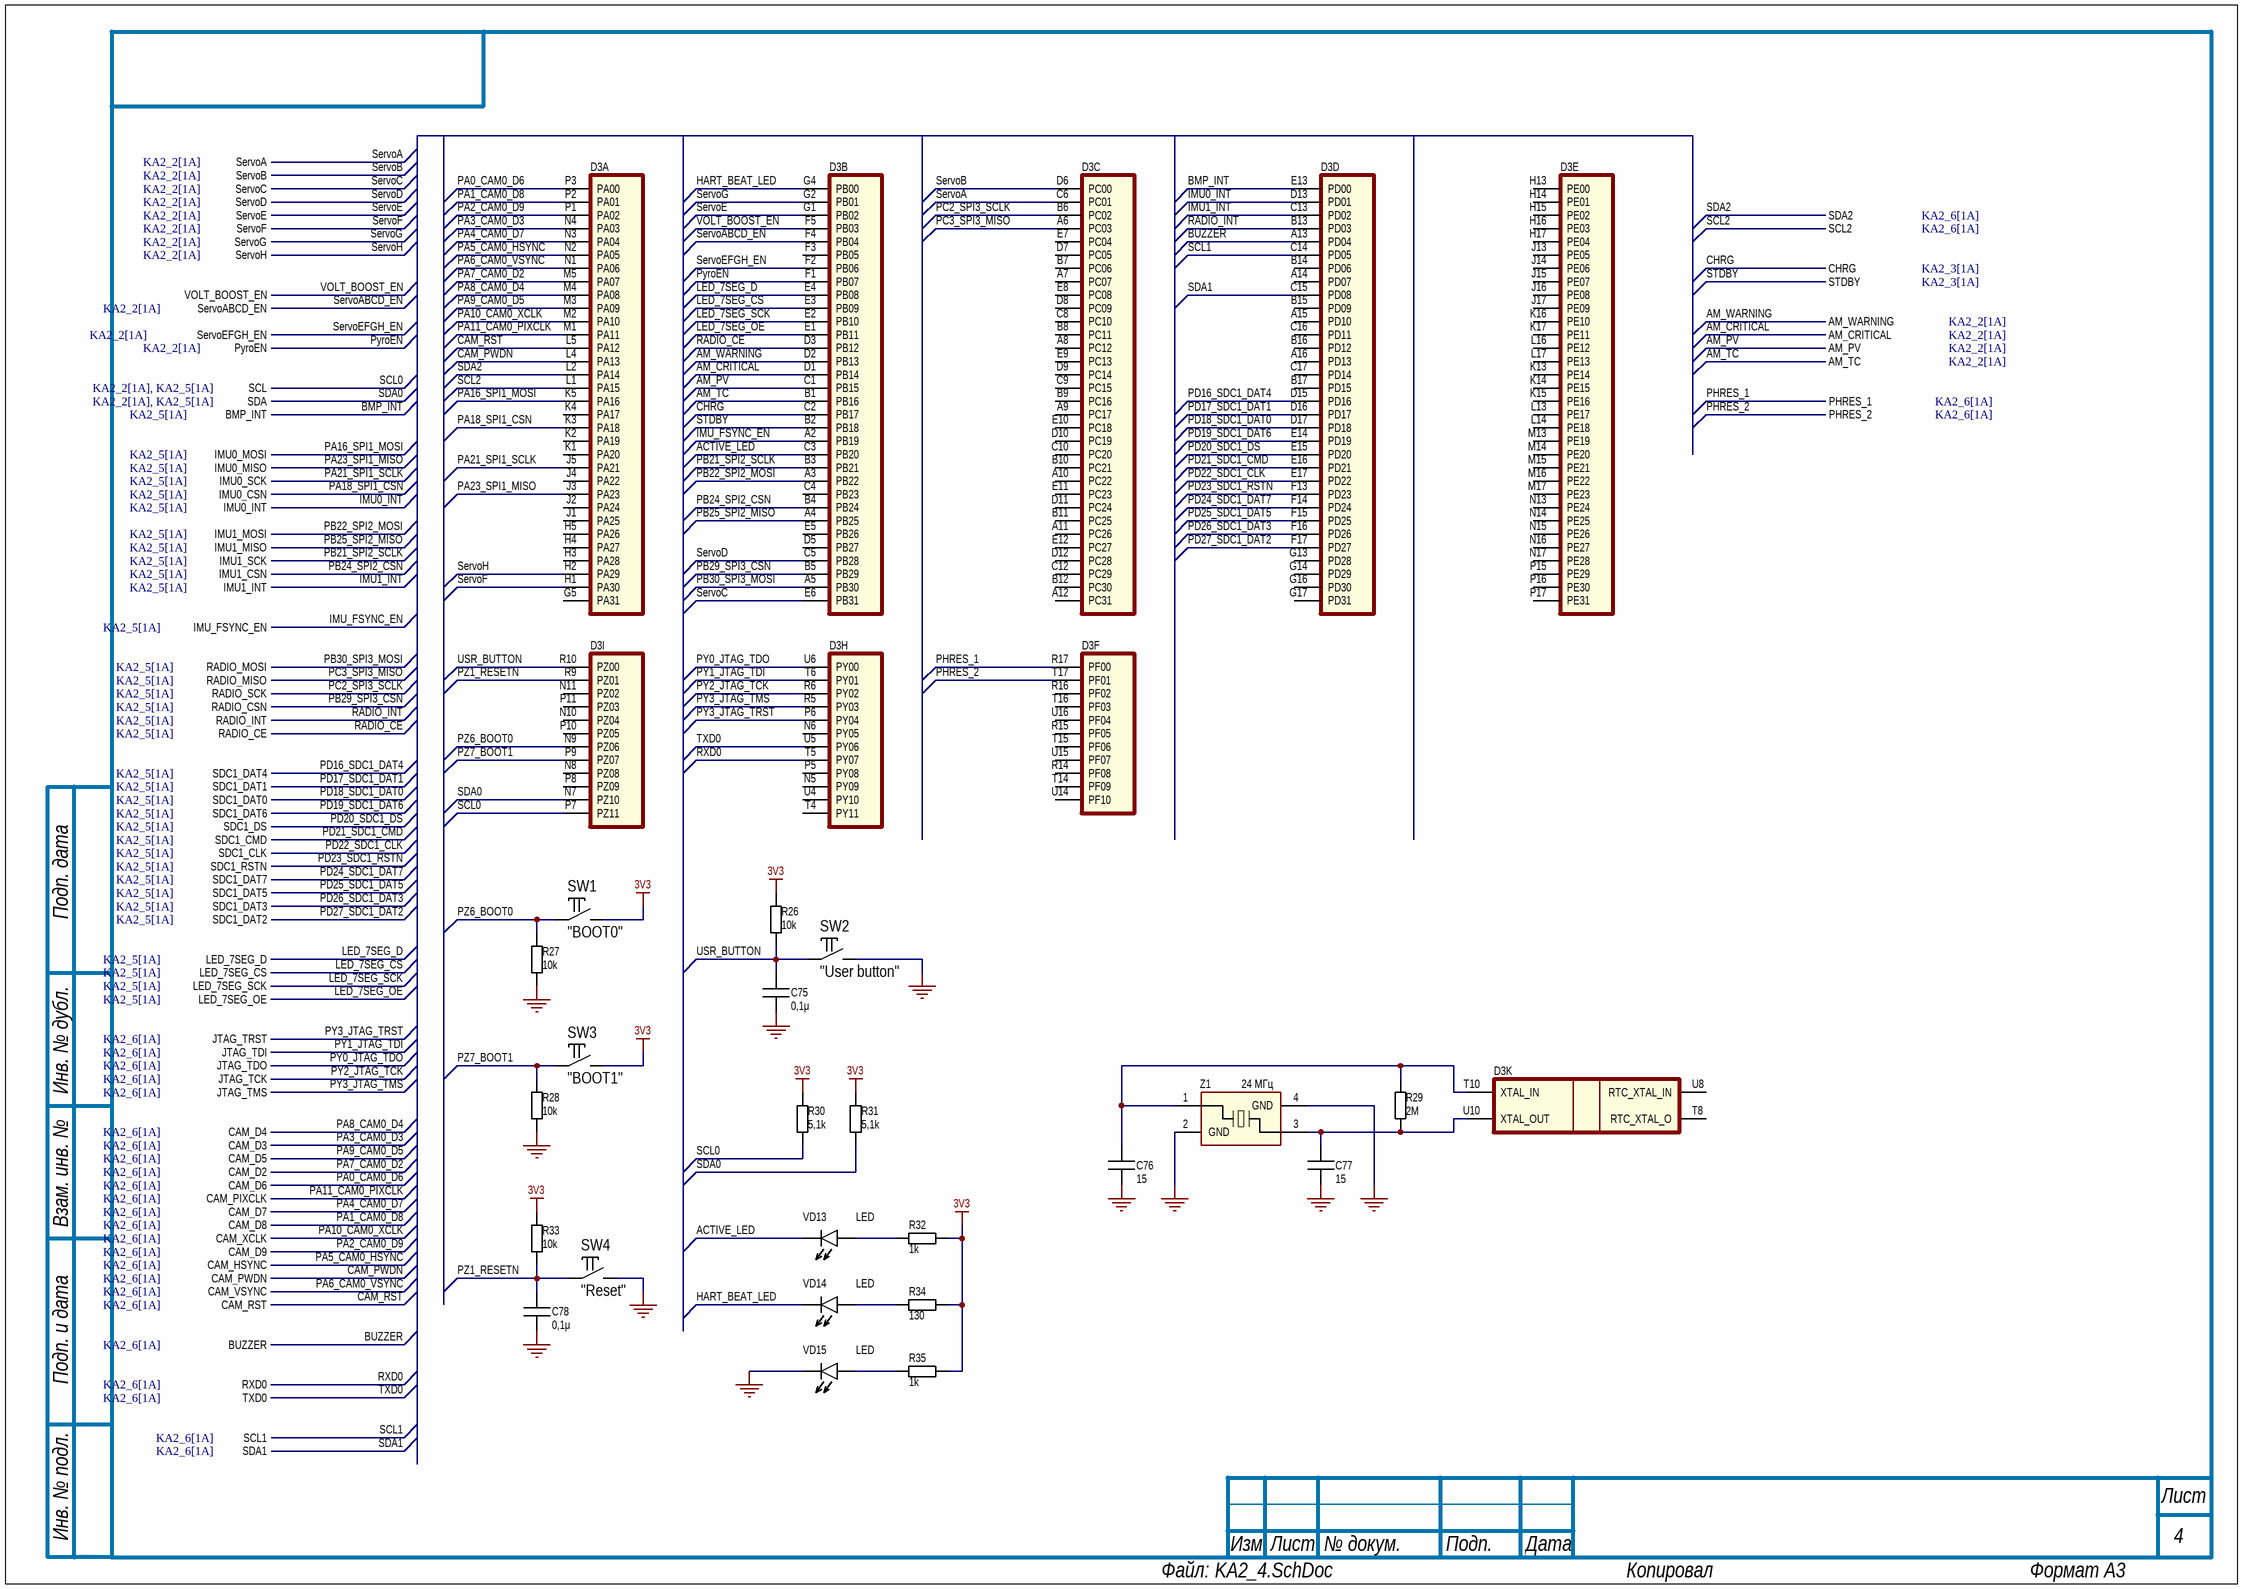
[diagram p3: KA2_4.SchDoc]

### Parts
C75  value 0,1μ  [Capacitor_0402]
C76  value 15  [Capacitor_0402]
C77  value 15  [Capacitor_0402]
C78  value 0,1μ  [Capacitor_0402]
D3  HPM6754IVM2  [HPM6754IVM2_BGA-289_14x14mm]  (value not drawn)  (parts A,B,C,D,E,F,H,I,K of 11)
R26  value 10k  [RES: 0402]
R27  value 10k  [RES: 0402]
R28  value 10k  [RES: 0402]
R29  value 2M  [RES: 0402]
R30  value 5,1k  [RES: 0402]
R31  value 5,1k  [RES: 0402]
R32  value 1k  [RES: 0402]
R33  value 10k  [RES: 0402]
R34  value 130  [RES: 0402]
R35  value 1k  [RES: 0402]
SW1  CommentText: "BOOT0"  [Button_4.2x2.3mm]  (hidden comment: Tactile Switch SPST 400gf 2.5mm 4.2mm x 3.2mm Surface Mount)
SW2  CommentText: "User button"  [Button_4.2x2.3mm]  (hidden comment: Tactile Switch SPST 400gf 2.5mm 4.2mm x 3.2mm Surface Mount)
SW3  CommentText: "BOOT1"  [Button_4.2x2.3mm]  (hidden comment: Tactile Switch SPST 400gf 2.5mm 4.2mm x 3.2mm Surface Mount)
SW4  CommentText: "Reset"  [Button_4.2x2.3mm]  (hidden comment: Tactile Switch SPST 400gf 2.5mm 4.2mm x 3.2mm Surface Mount)
VD13  value LED  [LED: 0603Y]  (hidden comment: LED_0603_Y)
VD14  value LED  [LED: 0603Y]  (hidden comment: 451nm LED Indication - Discrete 2.9V 0603)
VD15  value LED  [LED: 0603Y]  (hidden comment: LED_0603_Y)
Z1  value 24 МГц  [OSC: 2016]  (hidden comment: Crystal_XL7EL89CKI-111YLC-24M)

### Ports
AM_CRITICAL (see KA2_2[1A]), AM_PV (see KA2_2[1A]), AM_TC (see KA2_2[1A]), AM_WARNING (see KA2_2[1A]), BMP_INT (see KA2_5[1A]), BUZZER (see KA2_6[1A]), CAM_D2 (see KA2_6[1A]), CAM_D3 (see KA2_6[1A]), CAM_D4 (see KA2_6[1A]), CAM_D5 (see KA2_6[1A]), CAM_D6 (see KA2_6[1A]), CAM_D7 (see KA2_6[1A]), CAM_D8 (see KA2_6[1A]), CAM_D9 (see KA2_6[1A]), CAM_HSYNC (see KA2_6[1A]), CAM_PIXCLK (see KA2_6[1A]), CAM_PWDN (see KA2_6[1A]), CAM_RST (see KA2_6[1A]), CAM_VSYNC (see KA2_6[1A]), CAM_XCLK (see KA2_6[1A]), CHRG (see KA2_3[1A]), IMU0_CSN (see KA2_5[1A]), IMU0_INT (see KA2_5[1A]), IMU0_MISO (see KA2_5[1A]), IMU0_MOSI (see KA2_5[1A]), IMU0_SCK (see KA2_5[1A]), IMU1_CSN (see KA2_5[1A]), IMU1_INT (see KA2_5[1A]), IMU1_MISO (see KA2_5[1A]), IMU1_MOSI (see KA2_5[1A]), IMU1_SCK (see KA2_5[1A]), IMU_FSYNC_EN (see KA2_5[1A]), JTAG_TCK (see KA2_6[1A]), JTAG_TDI (see KA2_6[1A]), JTAG_TDO (see KA2_6[1A]), JTAG_TMS (see KA2_6[1A]), JTAG_TRST (see KA2_6[1A]), LED_7SEG_CS (see KA2_5[1A]), LED_7SEG_D (see KA2_5[1A]), LED_7SEG_OE (see KA2_5[1A]), LED_7SEG_SCK (see KA2_5[1A]), PHRES_1 (see KA2_6[1A]), PHRES_2 (see KA2_6[1A]), PyroEN (see KA2_2[1A]), RADIO_CE (see KA2_5[1A]), RADIO_CSN (see KA2_5[1A]), RADIO_INT (see KA2_5[1A]), RADIO_MISO (see KA2_5[1A]), RADIO_MOSI (see KA2_5[1A]), RADIO_SCK (see KA2_5[1A]), RXD0 (see KA2_6[1A]), SCL1 (see KA2_6[1A]), SCL2 (see KA2_6[1A]), SCL (see KA2_2[1A], KA2_5[1A]), SDA1 (see KA2_6[1A]), SDA2 (see KA2_6[1A]), SDA (see KA2_2[1A], KA2_5[1A]), SDC1_CLK (see KA2_5[1A]), SDC1_CMD (see KA2_5[1A]), SDC1_DAT0 (see KA2_5[1A]), SDC1_DAT1 (see KA2_5[1A]), SDC1_DAT2 (see KA2_5[1A]), SDC1_DAT3 (see KA2_5[1A]), SDC1_DAT4 (see KA2_5[1A]), SDC1_DAT5 (see KA2_5[1A]), SDC1_DAT6 (see KA2_5[1A]), SDC1_DAT7 (see KA2_5[1A]), SDC1_DS (see KA2_5[1A]), SDC1_RSTN (see KA2_5[1A]), ServoA (see KA2_2[1A]), ServoABCD_EN (see KA2_2[1A]), ServoB (see KA2_2[1A]), ServoC (see KA2_2[1A]), ServoD (see KA2_2[1A]), ServoE (see KA2_2[1A]), ServoEFGH_EN (see KA2_2[1A]), ServoF (see KA2_2[1A]), ServoG (see KA2_2[1A]), ServoH (see KA2_2[1A]), STDBY (see KA2_3[1A]), TXD0 (see KA2_6[1A]), VOLT_BOOST_EN

### Nets
3V3: R26.2 R30.2 R31.2 R32.1 R33.2 R34.1 R35.1 SW1.2 SW3.2
GND: C75.1 C76.1 C77.1 C78.1 R27.1 R28.1 SW2.2 SW4.2 VD15.K(Kathode) Z1.2(GND) Z1.4(GND)
ACTIVE_LED: D3.C3(PB20) VD13.K(Kathode)
AM_CRITICAL: D3.D1(PB14) ; port AM_CRITICAL
AM_PV: D3.C1(PB15) ; port AM_PV
AM_TC: D3.B1(PB16) ; port AM_TC
AM_WARNING: D3.D2(PB13) ; port AM_WARNING
BMP_INT: D3.E13(PD00) ; port BMP_INT
BUZZER: D3.A13(PD04) ; port BUZZER
CAM_PWDN: D3.L4(PA13) ; port CAM_PWDN
CAM_RST: D3.L5(PA12) ; port CAM_RST
CHRG: D3.C2(PB17) ; port CHRG
HART_BEAT_LED: D3.G4(PB00) VD14.K(Kathode)
IMU0_INT: D3.D13(PD01) ; port IMU0_INT
IMU1_INT: D3.C13(PD02) ; port IMU1_INT
IMU_FSYNC_EN: D3.A2(PB19) ; port IMU_FSYNC_EN
LED_7SEG_CS: D3.E3(PB09) ; port LED_7SEG_CS
LED_7SEG_D: D3.E4(PB08) ; port LED_7SEG_D
LED_7SEG_OE: D3.E1(PB11) ; port LED_7SEG_OE
LED_7SEG_SCK: D3.E2(PB10) ; port LED_7SEG_SCK
PA0_CAM0_D6: D3.P3(PA00) ; port CAM_D6
PA1_CAM0_D8: D3.P2(PA01) ; port CAM_D8
PA2_CAM0_D9: D3.P1(PA02) ; port CAM_D9
PA3_CAM0_D3: D3.N4(PA03) ; port CAM_D3
PA4_CAM0_D7: D3.N3(PA04) ; port CAM_D7
PA5_CAM0_HSYNC: D3.N2(PA05) ; port CAM_HSYNC
PA6_CAM0_VSYNC: D3.N1(PA06) ; port CAM_VSYNC
PA7_CAM0_D2: D3.M5(PA07) ; port CAM_D2
PA8_CAM0_D4: D3.M4(PA08) ; port CAM_D4
PA9_CAM0_D5: D3.M3(PA09) ; port CAM_D5
PA10_CAM0_XCLK: D3.M2(PA10) ; port CAM_XCLK
PA11_CAM0_PIXCLK: D3.M1(PA11) ; port CAM_PIXCLK
PA16_SPI1_MOSI: D3.K5(PA16) ; port IMU0_MOSI
PA18_SPI1_CSN: D3.K3(PA18) ; port IMU0_CSN
PA21_SPI1_SCLK: D3.J5(PA21) ; port IMU0_SCK
PA23_SPI1_MISO: D3.J3(PA23) ; port IMU0_MISO
PB21_SPI2_SCLK: D3.B3(PB21) ; port IMU1_SCK
PB22_SPI2_MOSI: D3.A3(PB22) ; port IMU1_MOSI
PB24_SPI2_CSN: D3.B4(PB24) ; port IMU1_CSN
PB25_SPI2_MISO: D3.A4(PB25) ; port IMU1_MISO
PB29_SPI3_CSN: D3.B5(PB29) ; port RADIO_CSN
PB30_SPI3_MOSI: D3.A5(PB30) ; port RADIO_MOSI
PC2_SPI3_SCLK: D3.B6(PC02) ; port RADIO_SCK
PC3_SPI3_MISO: D3.A6(PC03) ; port RADIO_MISO
PD16_SDC1_DAT4: D3.D15(PD16) ; port SDC1_DAT4
PD17_SDC1_DAT1: D3.D16(PD17) ; port SDC1_DAT1
PD18_SDC1_DAT0: D3.D17(PD18) ; port SDC1_DAT0
PD19_SDC1_DAT6: D3.E14(PD19) ; port SDC1_DAT6
PD20_SDC1_DS: D3.E15(PD20) ; port SDC1_DS
PD21_SDC1_CMD: D3.E16(PD21) ; port SDC1_CMD
PD22_SDC1_CLK: D3.E17(PD22) ; port SDC1_CLK
PD23_SDC1_RSTN: D3.F13(PD23) ; port SDC1_RSTN
PD24_SDC1_DAT7: D3.F14(PD24) ; port SDC1_DAT7
PD25_SDC1_DAT5: D3.F15(PD25) ; port SDC1_DAT5
PD26_SDC1_DAT3: D3.F16(PD26) ; port SDC1_DAT3
PD27_SDC1_DAT2: D3.F17(PD27) ; port SDC1_DAT2
PHRES_1: D3.R17(PF00) ; port PHRES_1
PHRES_2: D3.T17(PF01) ; port PHRES_2
PY0_JTAG_TDO: D3.U6(PY00) ; port JTAG_TDO
PY1_JTAG_TDI: D3.T6(PY01) ; port JTAG_TDI
PY2_JTAG_TCK: D3.R6(PY02) ; port JTAG_TCK
PY3_JTAG_TMS: D3.R5(PY03) ; port JTAG_TMS
PY3_JTAG_TRST: D3.P6(PY04) ; port JTAG_TRST
PyroEN: D3.F1(PB07) ; port PyroEN
PZ1_RESETN: C78.2 D3.R9(PZ01) R33.1 SW4.1
PZ6_BOOT0: D3.N9(PZ06) R27.2 SW1.1
PZ7_BOOT1: D3.P9(PZ07) R28.2 SW3.1
RADIO_CE: D3.D3(PB12) ; port RADIO_CE
RADIO_INT: D3.B13(PD03) ; port RADIO_INT
RXD0: D3.T5(PY07) ; port RXD0
SCL0: D3.P7(PZ11) R30.1 ; port SCL
SCL1: D3.C14(PD05) ; port SCL1
SCL2: D3.L1(PA15) ; port SCL2
SDA0: D3.N7(PZ10) R31.1 ; port SDA
SDA1: D3.C15(PD08) ; port SDA1
SDA2: D3.L2(PA14) ; port SDA2
ServoA: D3.C6(PC01) ; port ServoA
ServoABCD_EN: D3.F4(PB04) ; port ServoABCD_EN
ServoB: D3.D6(PC00) ; port ServoB
ServoC: D3.E6(PB31) ; port ServoC
ServoD: D3.C5(PB28) ; port ServoD
ServoE: D3.G1(PB02) ; port ServoE
ServoEFGH_EN: D3.F2(PB06) ; port ServoEFGH_EN
ServoF: D3.H1(PA30) ; port ServoF
ServoG: D3.G2(PB01) ; port ServoG
ServoH: D3.H2(PA29) ; port ServoH
STDBY: D3.B2(PB18) ; port STDBY
TXD0: D3.U5(PY06) ; port TXD0
USR_BUTTON: C75.2 D3.R10(PZ00) R26.1 SW2.1
VOLT_BOOST_EN: D3.F5(PB03) ; port VOLT_BOOST_EN
NetC76_2: C76.2 D3.T10(XTAL_IN) R29.2 Z1.1(X1)
NetC77_2: C77.2 D3.U10(XTAL_OUT) R29.1 Z1.3(X2)
NetR32_2: R32.2 VD13.A(Anode)
NetR34_2: R34.2 VD14.A(Anode)
NetR35_2: R35.2 VD15.A(Anode)

Not connected (* = marked no-connect by the designer): D3 A7(PC07) A8(PC12) A9(PC17) A10(PC22) A11(PC26) A12(PC31) A14(PD07) A15(PD10) A16(PD13) B7(PC06) B8(PC11) B9(PC16) B10(PC21) B11(PC25) B12(PC30) B14(PD06) B15(PD09) B16(PD12) B17(PD15) C4(PB23) C8(PC10) C9(PC15) C10(PC20) C12(PC29) C16(PD11) C17(PD14) D5(PB27) D7(PC05) D8(PC09) D9(PC14) D10(PC19) D11(PC24) D12(PC28) E5(PB26) E7(PC04) E8(PC08) E9(PC13) E10(PC18) E11(PC23) E12(PC27) F3(PB05) G5(PA31) G13(PD28) G14(PD29) G16(PD30) G17(PD31) H3(PA28) H4(PA27) H5(PA26) H13(PE00) H14(PE01) H15(PE02) H16(PE03) H17(PE04) J1(PA25) J2(PA24) J4(PA22) J13(PE05) J14(PE06) J15(PE07) J16(PE08) J17(PE09) K1(PA20) K2(PA19) K4(PA17) K13(PE14) K14(PE15) K15(PE16) K16(PE10) K17(PE11) L13(PE17) L14(PE18) L16(PE12) L17(PE13) M13(PE19) M14(PE20) M15(PE21) M16(PE22) M17(PE23) N5(PY09) N6(PY05) N8(PZ08) N10(PZ04) N11(PZ02) N13(PE24) N14(PE25) N15(PE26) N16(PE27) N17(PE28) P5(PY08) P8(PZ09) P10(PZ05) P11(PZ03) P15(PE29) P16(PE30) P17(PE31) R14(PF08) R15(PF05) R16(PF02) T4(PY11) T8(RTC_XTAL_O) T14(PF09) T15(PF06) T16(PF03) U4(PY10) U8(RTC_XTAL_IN) U14(PF10) U15(PF07) U16(PF04)

### Notes on the sheet
- Подп. дата
- Инв. № дубл.
- Взам. инв. №
- Подп. и дата
- Инв. № подл.
- Изм.
- Лист
- № докум.
- Подп.
- Дата
- ALTIUM GOSTBOM2.0 KEV
- Файл:
- Копировал
- Формат А3

### Library data of the parts
C75 C78 = Ceramic_0402: as C3 on sheet KA2_2; Manufacturer: *; HelpURL: *; Package: 0402; Mfr.Part: *
C76 C77 = Ceramic_0402: ValueManufacturerPartNumber: Ceramic capacitor, 15, X7R, ±10%, 16V, 0402; TypeCapacitor: Ceramic capacitor; Tolerance: ±10%; TypeDielectric: X7R; Voltage: 16V; Manufacturer: *; HelpURL: *; Package: 0402; Mfr.Part: *
D3 = HPM6754IVM2: as D3 on sheet KA2_3; Mfr.Part: HPM6754IVM2; Value: HPM6754IVM2; HelpURL: https://www.lcsc.com/product-detail/C49451874.html
R26-R28 R33 = Resistor_0402: as R4 on sheet KA2_2; Manufacturer: *; Package: 0402; Mfr.Part: *; TypeResistor: Resistor; HelpURL: *
R29 = Resistor_0402: ValueManufacturerPartNumber: Resistor, 2M, ±1%, 0402; Tolerance: ±1%; Manufacturer: *; Package: 0402; Mfr.Part: *; TypeResistor: Resistor; HelpURL: *
R30 R31 = Resistor_0402: as R16 on sheet KA2_3; Manufacturer: *; Package: 0402; Mfr.Part: *; TypeResistor: Resistor; HelpURL: *
R32 R35 = Resistor_0402: as R14 on sheet KA2_3; Manufacturer: *; Package: 0402; Mfr.Part: *; TypeResistor: Resistor; HelpURL: *
R34 = Resistor_0402: ValueManufacturerPartNumber: Resistor, 130, ±1%, 0402; Tolerance: ±1%; Manufacturer: *; Package: 0402; Mfr.Part: *; TypeResistor: Resistor; HelpURL: *
SW1-SW4 = Switch_GT-TC048D-H025-L1: Микропереключатель SMD, SMD-4P,4.2x3.2mm; Manufacturer: G-Switch; HelpURL: https://www.lcsc.com/product-detail/C843674.html; Mfr.Part: GT-TC048D-H025-L1
VD13 VD15 = LED_0603_Y: as VD11 on sheet KA2_3; HelpURL: https://www.lcsc.com/product-detail/C2837010.html
VD14 = LED_0603_W: Светодиод белый, 0603; Mfr.Part: TZ0603W3G-001/2#; Manufacturer: TUOZHAN; HelpURL: https://www.lcsc.com/product-detail/C3011232.html
Z1 = Crystal_XL7EL89CKI-111YLC-24M: Кварцевый резонатор 24 МГц 2016; Manufacturer: YXC Crystal Oscillators; Mfr.Part: XL7EL89CKI-111YLC-24M; HelpURL: https://www.lcsc.com/product-detail/C2965580.html

## Sheet KA2_5.SchDoc
size 420 x 297 mm; SheetNumber: 5; SheetTotal: 6
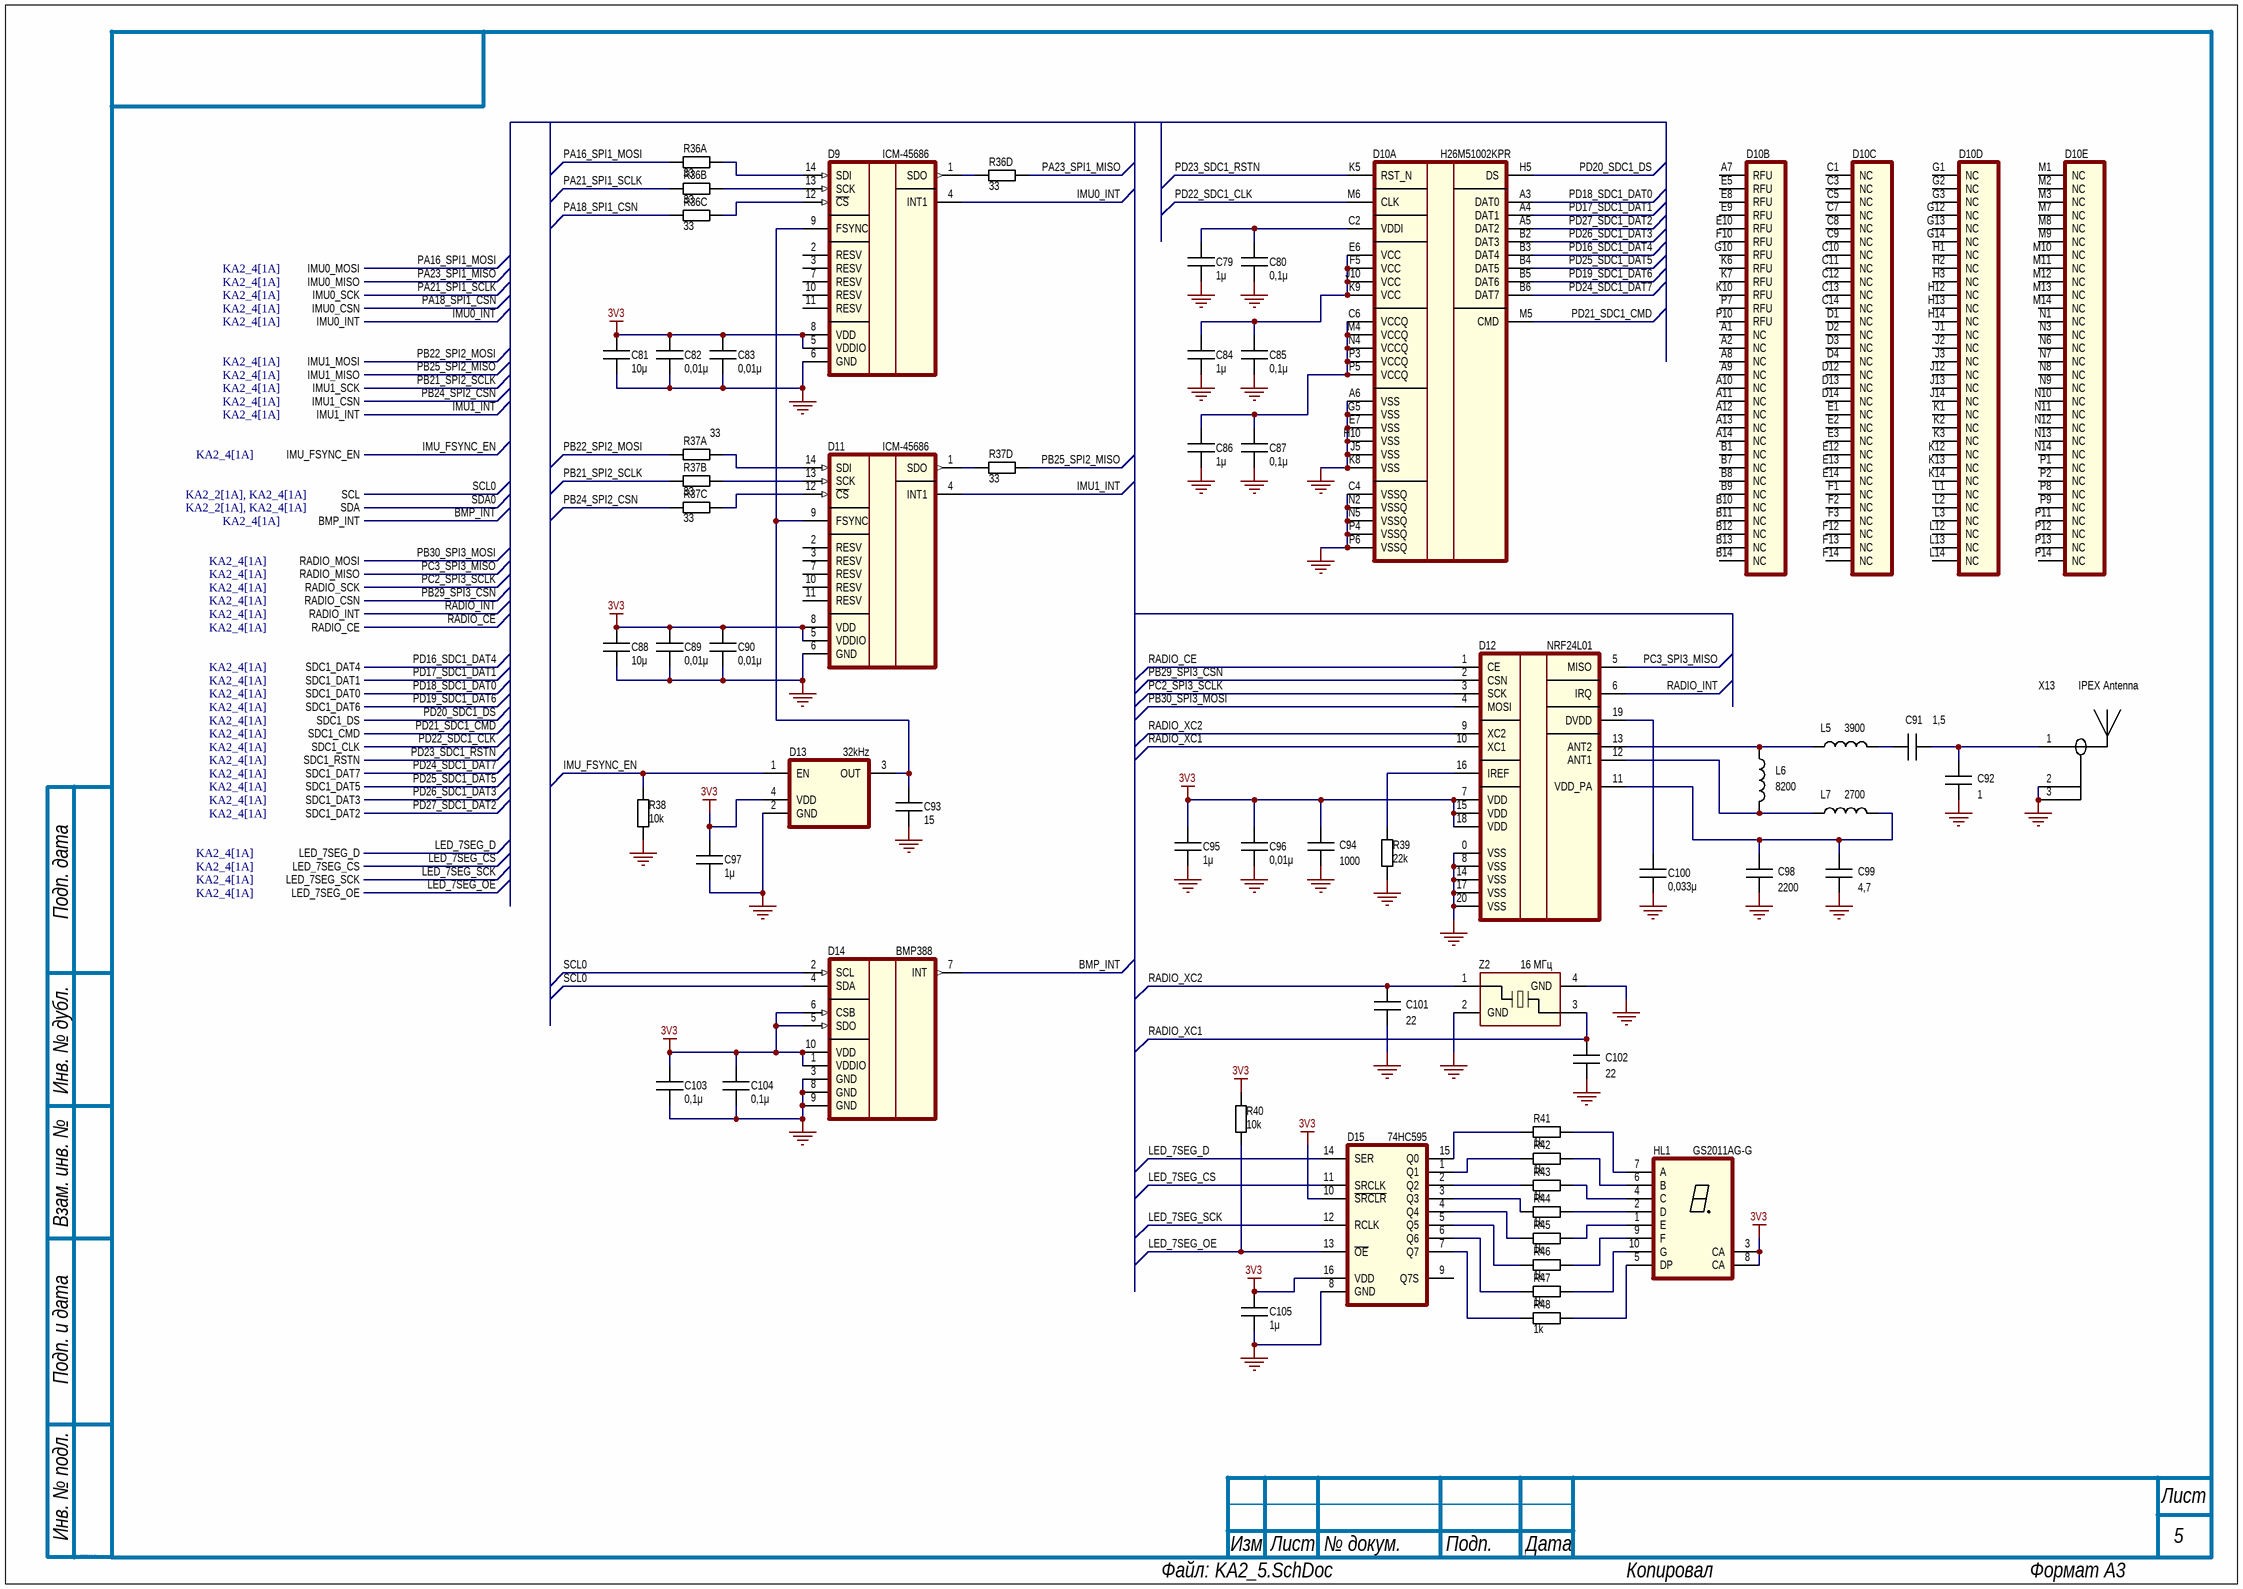
[diagram p4: KA2_5.SchDoc]

### Parts
C79  value 1μ  [Capacitor_0402]
C80  value 0,1μ  [Capacitor_0402]
C81  value 10μ  [Capacitor_0402]
C82  value 0,01μ  [Capacitor_0402]
C83  value 0,01μ  [Capacitor_0402]
C84  value 1μ  [Capacitor_0402]
C85  value 0,1μ  [Capacitor_0402]
C86  value 1μ  [Capacitor_0402]
C87  value 0,1μ  [Capacitor_0402]
C88  value 10μ  [Capacitor_0402]
C89  value 0,01μ  [Capacitor_0402]
C90  value 0,01μ  [Capacitor_0402]
C91  value 1,5  [Capacitor_0402]
C92  value 1  [Capacitor_0402]
C93  value 15  [Capacitor_0402]
C94  value 1000  [Capacitor_0402]
C95  value 1μ  [Capacitor_0402]
C96  value 0,01μ  [Capacitor_0402]
C97  value 1μ  [Capacitor_0402]
C98  value 2200  [Capacitor_0402]
C99  value 4,7  [Capacitor_0402]
C100  value 0,033μ  [Capacitor_0402]
C101  value 22  [Capacitor_0402]
C102  value 22  [Capacitor_0402]
C103  value 0,1μ  [Capacitor_0402]
C104  value 0,1μ  [Capacitor_0402]
C105  value 1μ  [Capacitor_0402]
D9  ICM-45686  [ICM-42688-P_LGA-14_3x2.5mm]
D10  value H26M51002KPR  [eMMC_13x11.5mm]  (hidden comment: 16GB eMMC 5.1 FBGA-153 Memory (ICs) RoHS)  (parts A,B,C,D,E of 5)
D11  ICM-45686  [ICM-42688-P_LGA-14_3x2.5mm]
D12  value NRF24L01  [QFN-20_4x4mm]  (hidden comment: NRF24L01P-R)
D13  value 32kHz  [OSC: 2016]  (hidden comment: OK7EL89CJI-111YLC-32.768K)
D14  BMP388  [BMP388_LGA-10_2x2mm]
D15  value 74HC595  [TSSOP-16]  (hidden comment: SN74HC595PWR)
HL1  GS2011AG-G  [LED_7SEG_SMD]
L5  value 3900  [IND: 0402]
L6  value 8200  [IND: 0402]
L7  value 2700  [IND: 0402]
R36  value 33  [RES: Array 4x0402]  (parts A,B,C,D of 4)
R37  value 33  [RES: Array 4x0402]  (parts A,B,C,D of 4)
R38  value 10k  [RES: 0402]
R39  value 22k  [RES: 0402]
R40  value 10k  [RES: 0402]
R41  value 1k  [RES: 0402]
R42  value 1k  [RES: 0402]
R43  value 1k  [RES: 0402]
R44  value 1k  [RES: 0402]
R45  value 1k  [RES: 0402]
R46  value 1k  [RES: 0402]
R47  value 1k  [RES: 0402]
R48  value 1k  [RES: 0402]
X13  value IPEX Antenna  [Conn_IPEX_ANTENNA]  (hidden comment: Connector Receptacle IPEX Male Pin 50Ω Surface Mount)
Z2  value 16 МГц  [OSC: 2016]  (hidden comment: Crystal 16MHz ±10ppm 12pF SMD2016-4P)

### Ports
BMP_INT (see KA2_4[1A]), IMU0_CSN (see KA2_4[1A]), IMU0_INT (see KA2_4[1A]), IMU0_MISO (see KA2_4[1A]), IMU0_MOSI (see KA2_4[1A]), IMU0_SCK (see KA2_4[1A]), IMU1_CSN (see KA2_4[1A]), IMU1_INT (see KA2_4[1A]), IMU1_MISO (see KA2_4[1A]), IMU1_MOSI (see KA2_4[1A]), IMU1_SCK (see KA2_4[1A]), IMU_FSYNC_EN (see KA2_4[1A]), LED_7SEG_CS (see KA2_4[1A]), LED_7SEG_D (see KA2_4[1A]), LED_7SEG_OE (see KA2_4[1A]), LED_7SEG_SCK (see KA2_4[1A]), RADIO_CE (see KA2_4[1A]), RADIO_CSN (see KA2_4[1A]), RADIO_INT (see KA2_4[1A]), RADIO_MISO (see KA2_4[1A]), RADIO_MOSI (see KA2_4[1A]), RADIO_SCK (see KA2_4[1A]), SCL (see KA2_2[1A], KA2_4[1A]), SDA (see KA2_2[1A], KA2_4[1A]), SDC1_CLK (see KA2_4[1A]), SDC1_CMD (see KA2_4[1A]), SDC1_DAT0 (see KA2_4[1A]), SDC1_DAT1 (see KA2_4[1A]), SDC1_DAT2 (see KA2_4[1A]), SDC1_DAT3 (see KA2_4[1A]), SDC1_DAT4 (see KA2_4[1A]), SDC1_DAT5 (see KA2_4[1A]), SDC1_DAT6 (see KA2_4[1A]), SDC1_DAT7 (see KA2_4[1A]), SDC1_DS (see KA2_4[1A]), SDC1_RSTN (see KA2_4[1A])

### Nets
3V3: C81.2 C82.2 C83.2 C88.2 C89.2 C90.2 C94.1 C95.2 C96.2 C97.2 C103.2 C104.2 C105.2 D9.5(VDDIO) D9.8(VDD) D11.5(VDDIO) D11.8(VDD) D12.7(VDD) D12.15(VDD) D12.18(VDD) D13.4(VDD) D14.1(VDDIO) D14.5(SDO) D14.6(CSB) D14.10(VDD) D15.10(~{SRCLR}) D15.16(VDD) HL1.3(CA) HL1.8(CA) R40.2
GND: C79.1 C80.1 C81.1 C82.1 C83.1 C84.1 C85.1 C86.1 C87.1 C88.1 C89.1 C90.1 C92.2 C93.1 C94.2 C95.1 C96.1 C97.1 C98.2 C99.2 C100.1 C101.2 C102.2 C103.1 C104.1 C105.1 D9.6(GND) D10.A6(VSS) D10.C4(VSSQ) D10.E7(VSS) D10.G5(VSS) D10.H10(VSS) D10.J5(VSS) D10.K8(VSS) D10.N2(VSSQ) D10.N5(VSSQ) D10.P4(VSSQ) D10.P6(VSSQ) D11.6(GND) D12.0(VSS) D12.8(VSS) D12.14(VSS) D12.17(VSS) D12.20(VSS) D13.2(GND) D14.3(GND) D14.8(GND) D14.9(GND) D15.8(GND) R38.1 R39.1 X13.2(GND) X13.3(GND) Z2.2(GND) Z2.4(GND)
BMP_INT: D14.7(INT) ; port BMP_INT
IMU0_INT: D9.4(INT1) ; port IMU0_INT
IMU1_INT: D11.4(INT1) ; port IMU1_INT
IMU_FSYNC_EN: D13.1(EN) R38.2 ; port IMU_FSYNC_EN
LED_7SEG_CS: D15.11(SRCLK) ; port LED_7SEG_CS
LED_7SEG_D: D15.14(SER) ; port LED_7SEG_D
LED_7SEG_OE: D15.13(~{OE}) R40.1 ; port LED_7SEG_OE
LED_7SEG_SCK: D15.12(RCLK) ; port LED_7SEG_SCK
PA16_SPI1_MOSI: R36.1 ; port IMU0_MOSI
PA18_SPI1_CSN: R36.3 ; port IMU0_CSN
PA21_SPI1_SCLK: R36.2 ; port IMU0_SCK
PA23_SPI1_MISO: R36.5 ; port IMU0_MISO
PB21_SPI2_SCLK: R37.2 ; port IMU1_SCK
PB22_SPI2_MOSI: R37.1 ; port IMU1_MOSI
PB24_SPI2_CSN: R37.3 ; port IMU1_CSN
PB25_SPI2_MISO: R37.5 ; port IMU1_MISO
PB29_SPI3_CSN: D12.2(CSN) ; port RADIO_CSN
PB30_SPI3_MOSI: D12.4(MOSI) ; port RADIO_MOSI
PC2_SPI3_SCLK: D12.3(SCK) ; port RADIO_SCK
PC3_SPI3_MISO: D12.5(MISO) ; port RADIO_MISO
PD16_SDC1_DAT4: D10.B3(DAT4) ; port SDC1_DAT4
PD17_SDC1_DAT1: D10.A4(DAT1) ; port SDC1_DAT1
PD18_SDC1_DAT0: D10.A3(DAT0) ; port SDC1_DAT0
PD19_SDC1_DAT6: D10.B5(DAT6) ; port SDC1_DAT6
PD20_SDC1_DS: D10.H5(DS) ; port SDC1_DS
PD21_SDC1_CMD: D10.M5(CMD) ; port SDC1_CMD
PD22_SDC1_CLK: D10.M6(CLK) ; port SDC1_CLK
PD23_SDC1_RSTN: D10.K5(RST_N) ; port SDC1_RSTN
PD24_SDC1_DAT7: D10.B6(DAT7) ; port SDC1_DAT7
PD25_SDC1_DAT5: D10.B4(DAT5) ; port SDC1_DAT5
PD26_SDC1_DAT3: D10.B2(DAT3) ; port SDC1_DAT3
PD27_SDC1_DAT2: D10.A5(DAT2) ; port SDC1_DAT2
RADIO_CE: D12.1(CE) ; port RADIO_CE
RADIO_INT: D12.6(IRQ) ; port RADIO_INT
RADIO_XC1: C102.1 D12.10(XC1) Z2.3(X2)
RADIO_XC2: C101.1 D12.9(XC2) Z2.1(X1)
SCL0: D14.2(SCL) D14.4(SDA) ; port SCL
NetC79_2: C79.2 C80.2 D10.C2(VDDI)
NetC84_2: C84.2 C85.2 D10.E6(VCC) D10.F5(VCC) D10.J10(VCC) D10.K9(VCC)
NetC86_2: C86.2 C87.2 D10.C6(VCCQ) D10.M4(VCCQ) D10.N4(VCCQ) D10.P3(VCCQ) D10.P5(VCCQ)
NetC91_1: C91.1 C92.1 X13.1(Antenna)
NetC91_2: C91.2 L5.1
NetC93_2: C93.2 D9.9(FSYNC) D11.9(FSYNC) D13.3(OUT)
NetC98_1: C98.1 C99.1 D12.11(VDD_PA) L7.1
NetC100_2: C100.2 D12.19(DVDD)
NetD9_1: D9.1(SDO) R36.4
NetD9_12: D9.12(~{CS}) R36.6
NetD9_13: D9.13(SCK) R36.7
NetD9_14: D9.14(SDI) R36.8
NetD11_1: D11.1(SDO) R37.4
NetD11_12: D11.12(~{CS}) R37.6
NetD11_13: D11.13(SCK) R37.7
NetD11_14: D11.14(SDI) R37.8
NetD12_12: D12.12(ANT1) L6.1 L7.2
NetD12_13: D12.13(ANT2) L5.2 L6.2
NetD12_16: D12.16(IREF) R39.2
NetD15_1: D15.1(Q1) R42.2
NetD15_2: D15.2(Q2) R43.2
NetD15_3: D15.3(Q3) R44.2
NetD15_4: D15.4(Q4) R45.2
NetD15_5: D15.5(Q5) R46.2
NetD15_6: D15.6(Q6) R47.2
NetD15_7: D15.7(Q7) R48.2
NetD15_15: D15.15(Q0) R41.2
NetHL1_1: HL1.1(E) R45.1
NetHL1_2: HL1.2(D) R44.1
NetHL1_4: HL1.4(C) R43.1
NetHL1_5: HL1.5(DP) R48.1
NetHL1_6: HL1.6(B) R42.1
NetHL1_7: HL1.7(A) R41.1
NetHL1_9: HL1.9(F) R46.1
NetHL1_10: HL1.10(G) R47.1

Not connected (* = marked no-connect by the designer): D9 2(RESV) 3(RESV) 7(RESV) 10(RESV) 11(RESV); D10 A1(NC) A2(NC) A7(RFU) A8(NC) A9(NC) A10(NC) A11(NC) A12(NC) A13(NC) A14(NC) B1(NC) B7(NC) B8(NC) B9(NC) B10(NC) B11(NC) B12(NC) B13(NC) B14(NC) C1(NC) C3(NC) C5(NC) C7(NC) C8(NC) C9(NC) C10(NC) C11(NC) C12(NC) C13(NC) C14(NC) D1(NC) D2(NC) D3(NC) D4(NC) D12(NC) D13(NC) D14(NC) E1(NC) E2(NC) E3(NC) E5(RFU) E8(RFU) E9(RFU) E10(RFU) E12(NC) E13(NC) E14(NC) F1(NC) F2(NC) F3(NC) F10(RFU) F12(NC) F13(NC) F14(NC) G1(NC) G2(NC) G3(NC) G10(RFU) G12(NC) G13(NC) G14(NC) H1(NC) H2(NC) H3(NC) H12(NC) H13(NC) H14(NC) J1(NC) J2(NC) J3(NC) J12(NC) J13(NC) J14(NC) K1(NC) K2(NC) K3(NC) K6(RFU) K7(RFU) K10(RFU) K12(NC) K13(NC) K14(NC) L1(NC) L2(NC) L3(NC) L12(NC) L13(NC) L14(NC) M1(NC) M2(NC) M3(NC) M7(NC) M8(NC) M9(NC) M10(NC) M11(NC) M12(NC) M13(NC) M14(NC) N1(NC) N3(NC) N6(NC) N7(NC) N8(NC) N9(NC) N10(NC) N11(NC) N12(NC) N13(NC) N14(NC) P1(NC) P2(NC) P7(RFU) P8(NC) P9(NC) P10(RFU) P11(NC) P12(NC) P13(NC) P14(NC); D11 2(RESV) 3(RESV) 7(RESV) 10(RESV) 11(RESV); D15 9(Q7S)

### Notes on the sheet
- Подп. дата
- Инв. № дубл.
- Взам. инв. №
- Подп. и дата
- Инв. № подл.
- Изм.
- Лист
- № докум.
- Подп.
- Дата
- ALTIUM GOSTBOM2.0 KEV
- Файл:
- Копировал
- Формат А3

### Library data of the parts
C79 C84 C86 C95 C97 C105 = Ceramic_0402: as C10 on sheet KA2_2; Manufacturer: *; HelpURL: *; Package: 0402; Mfr.Part: *
C80 C85 C87 C103 C104 = Ceramic_0402: as C3 on sheet KA2_2; Manufacturer: *; HelpURL: *; Package: 0402; Mfr.Part: *
C81 C88 = Ceramic_0402: as C20 on sheet KA2_3; Manufacturer: *; HelpURL: *; Package: 0402; Mfr.Part: *
C82 C83 C89 C90 C96 = Ceramic_0402: ValueManufacturerPartNumber: Ceramic capacitor, 0,01μ, X7R, ±10%, 16V, 0402; TypeCapacitor: Ceramic capacitor; Tolerance: ±10%; TypeDielectric: X7R; Voltage: 16V; Manufacturer: *; HelpURL: *; Package: 0402; Mfr.Part: *
C91 = Ceramic_0402: ValueManufacturerPartNumber: Ceramic capacitor, 1,5, X7R, ±10%, 16V, 0402; TypeCapacitor: Ceramic capacitor; Tolerance: ±10%; TypeDielectric: X7R; Voltage: 16V; Manufacturer: *; HelpURL: *; Package: 0402; Mfr.Part: *
C92 = Ceramic_0402: ValueManufacturerPartNumber: Ceramic capacitor, 1, X7R, ±10%, 16V, 0402; TypeCapacitor: Ceramic capacitor; Tolerance: ±10%; TypeDielectric: X7R; Voltage: 16V; Manufacturer: *; HelpURL: *; Package: 0402; Mfr.Part: *
C93 = Ceramic_0402: as C76 on sheet KA2_4; Manufacturer: *; HelpURL: *; Package: 0402; Mfr.Part: *
C94 = Ceramic_0402: ValueManufacturerPartNumber: Ceramic capacitor, 1000, X7R, ±10%, 16V, 0402; TypeCapacitor: Ceramic capacitor; Tolerance: ±10%; TypeDielectric: X7R; Voltage: 16V; Manufacturer: *; HelpURL: *; Package: 0402; Mfr.Part: *
C98 = Ceramic_0402: ValueManufacturerPartNumber: Ceramic capacitor, 2200, X7R, ±10%, 16V, 0402; TypeCapacitor: Ceramic capacitor; Tolerance: ±10%; TypeDielectric: X7R; Voltage: 16V; Manufacturer: *; HelpURL: *; Package: 0402; Mfr.Part: *
C99 = Ceramic_0402: ValueManufacturerPartNumber: Ceramic capacitor, 4,7, X7R, ±10%, 16V, 0402; TypeCapacitor: Ceramic capacitor; Tolerance: ±10%; TypeDielectric: X7R; Voltage: 16V; Manufacturer: *; HelpURL: *; Package: 0402; Mfr.Part: *
C100 = Ceramic_0402: ValueManufacturerPartNumber: Ceramic capacitor, 0,033μ, X7R, ±10%, 16V, 0402; TypeCapacitor: Ceramic capacitor; Tolerance: ±10%; TypeDielectric: X7R; Voltage: 16V; Manufacturer: *; HelpURL: *; Package: 0402; Mfr.Part: *
C101 C102 = Ceramic_0402: ValueManufacturerPartNumber: Ceramic capacitor, 22, X7R, ±10%, 16V, 0402; TypeCapacitor: Ceramic capacitor; Tolerance: ±10%; TypeDielectric: X7R; Voltage: 16V; Manufacturer: *; HelpURL: *; Package: 0402; Mfr.Part: *
D9 D11 = ICM-45686: Микросхема интегрального гироскопа-акселерометра (IMU), LGA-14 3x2.5mm; Manufacturer: TDK InvenSense; Mfr.Part: ICM-45686; Value: ICM-45686; HelpURL: *
D10 = eMMC_H26M51002KPR: Микросхема eMMC, 16ГБ, FBGA-153 13x11.5mm; Manufacturer: HYNIX; Mfr.Part: H26M51002KPR; HelpURL: https://www.lcsc.com/product-detail/C3002775.html
D12 = NRF24L01P-R: Микросхема радио-приемопередатчика 2.4 ГГц, QFN-20 4x4mm; Manufacturer: Nordic Semicomductor; Mfr.Part: NRF24L01P-R; HelpURL: https://www.lcsc.com/product-detail/C8791.html
D13 = OK7EL89CJI-111YLC-32.768K: Кварцевый генератор 32,768 кГц, 2016, 10ppm; Manufacturer: YXC Crystal Oscillators; Mfr.Part: OK7EL89CJI-111YLC-32.768K; HelpURL: https://www.lcsc.com/product-detail/C7425462.html
D14 = BMP388: Микросхема интегрального барометра, LGA-10 2x2mm; Manufacturer: Bosch; Mfr.Part: BMP388; Value: BMP388; HelpURL: https://www.lcsc.com/product-detail/C779278.html
D15 = SN74HC595PWR: Микросхема восьмиразрядного сдвигового регистра; Manufacturer: Texas Instruments; Mfr.Part: SN74HC595PWR; HelpURL: https://www.lcsc.com/product-detail/C273642.html
HL1 = GS2011AG-G: Индикатор светодиодный семисегментный зеленый, SMD, 10x6.9 мм, общий анод; Manufacturer: Guangcai Display; Value: GS2011AG-G; Mfr.Part: GS2011AG-G; HelpURL: https://www.lcsc.com/product-detail/C22462633.html
L5 = Inductor_0402: ValueManufacturerPartNumber: Inductor, 3900, ±10%, 0402; Tolerance: ±10%; Manufacturer: *; Mfr.Part: *; Package: 0402; TypeInductor: Inductor; HelpURL: *
L6 = Inductor_0402: ValueManufacturerPartNumber: Inductor, 8200, ±10%, 0402; Tolerance: ±10%; Manufacturer: *; Mfr.Part: *; Package: 0402; TypeInductor: Inductor; HelpURL: *
L7 = Inductor_0402: ValueManufacturerPartNumber: Inductor, 2700, ±10%, 0402; Tolerance: ±10%; Manufacturer: *; Mfr.Part: *; Package: 0402; TypeInductor: Inductor; HelpURL: *
R36 R37 = ResistorArray_0402_4: ValueManufacturerPartNumber: Resistor array (4), 33, ±1%, 0402; TypeResistor: Resistor array (4); Tolerance: ±1%; Manufacturer: *; Mfr.Part: *; Package: 0402; HelpURL: *
R38 R40 = Resistor_0402: as R4 on sheet KA2_2; Manufacturer: *; Package: 0402; Mfr.Part: *; TypeResistor: Resistor; HelpURL: *
R39 = Resistor_0402: ValueManufacturerPartNumber: Resistor, 22k, ±1%, 0402; Tolerance: ±1%; Manufacturer: *; Package: 0402; Mfr.Part: *; TypeResistor: Resistor; HelpURL: *
R41-R48 = Resistor_0402: as R14 on sheet KA2_3; Manufacturer: *; Package: 0402; Mfr.Part: *; TypeResistor: Resistor; HelpURL: *
X13 = Antenna_IPEX: Manufacturer: HRS; Mfr.Part: U.FL-R-SMT-1(80); HelpURL: https://www.lcsc.com/product-detail/C88374.html
Z2 = Crystal_XL7EL89COI-111YLC-16M: Кварцевый резонатор 16 МГц 2016; Manufacturer: YXC Crystal Oscillators; Mfr.Part: XL7EL89COI-111YLC-16M; HelpURL: https://www.lcsc.com/product-detail/C2965579.html